# EAGLE design task_eagle (EAGLE 8.0.1)

## Sheet 1 of 5: Controller
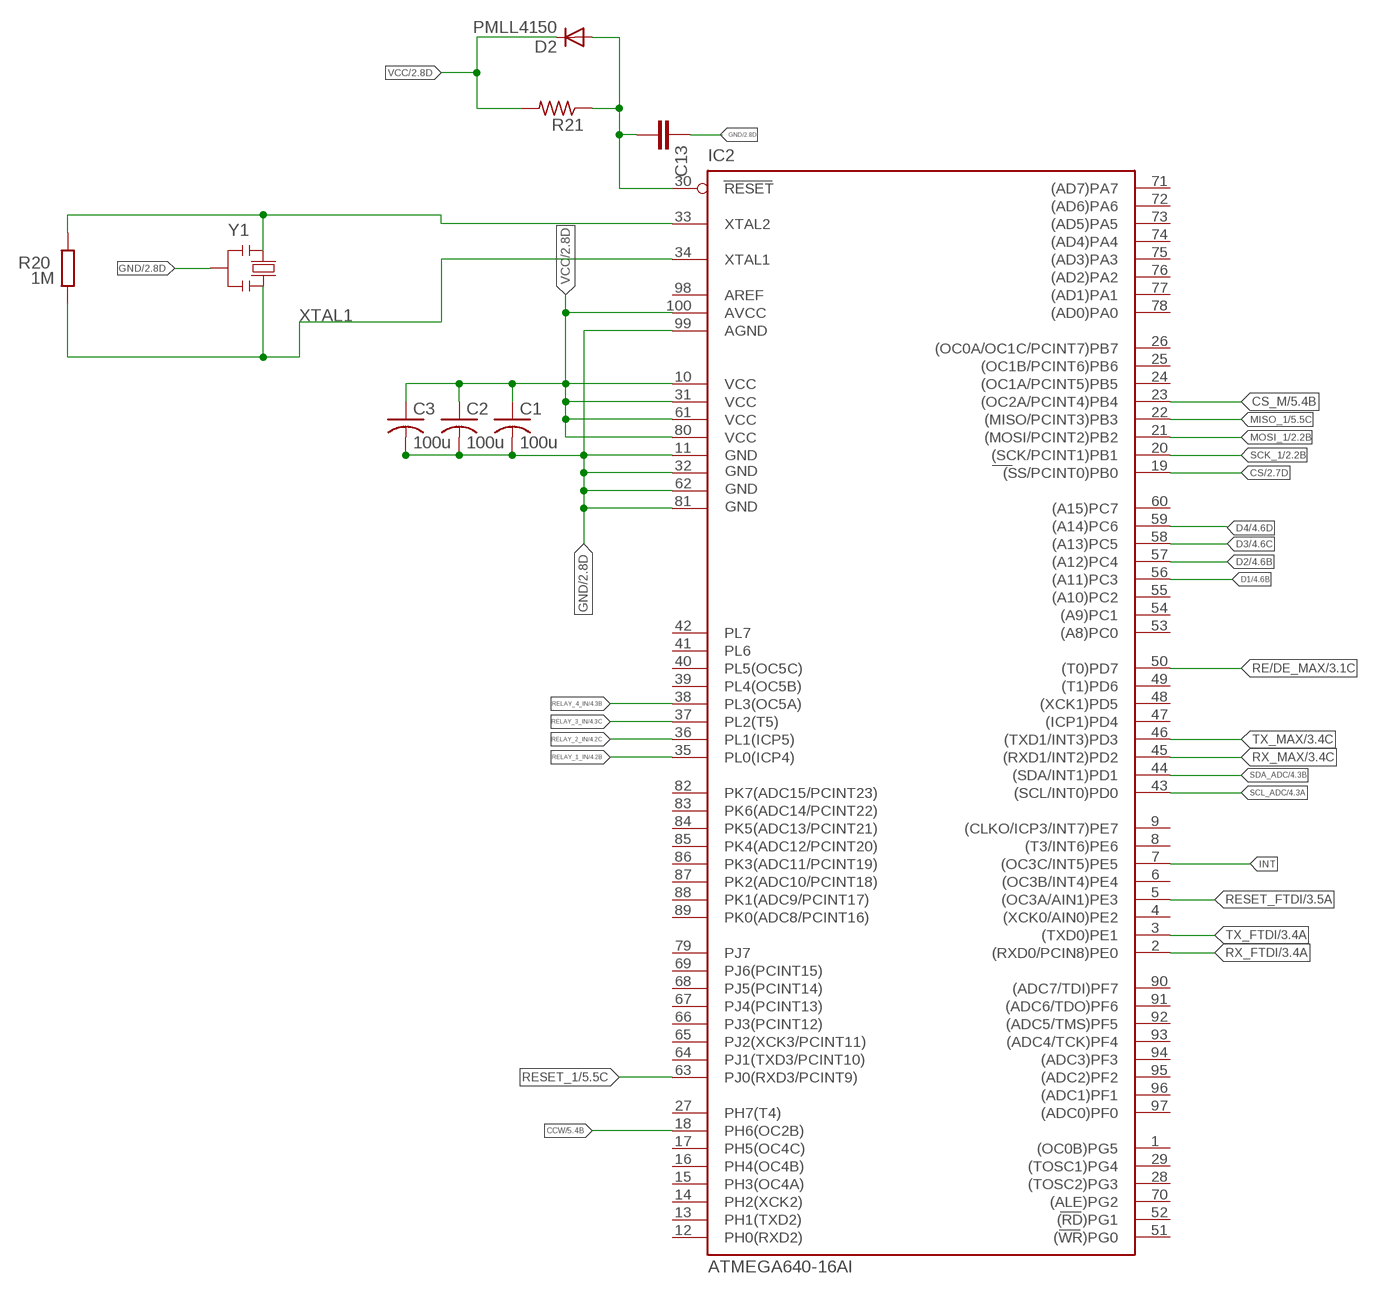
[diagram p0: schematic, sheet 1]

### Parts
C1  100u  C-USC0603  [C0603]
C2  100u  C-USC0603  [C0603]
C3  100u  C-USC0603  [C0603]
C13  CC0603  [C0603]
D2  PMLL4150  [SOD80C]
IC2  ATMEGA640-16AI  [TQFP100]
R20  1M  R-EU_R0603  [R0603-ROUND]
R21  R-US_R0603  [R0603]
Y1  RESONATORMU  [RESONATOR]

### Nets
CCW: IC2.18(PH6(OC2B)) ; also sheet 5
CS: IC2.19((SS/PCINT0)PB0) ; also sheet 2
CS_M: IC2.23((OC2A/PCINT4)PB4) ; also sheet 5
D1: IC2.56((A11)PC3) ; also sheet 4
D2: IC2.57((A12)PC4) ; also sheet 4
D3: IC2.58((A13)PC5) ; also sheet 4
D4: IC2.59((A14)PC6) ; also sheet 4
GND [def]: C1.2 C2.2 C3.2 C13.1 IC2.11(GND) IC2.32(GND1) IC2.62(GND2) IC2.81(GND3) IC2.99(AGND) Y1.2 ; also sheet 2,3,4,5
INT: IC2.7((OC3C/INT5)PE5) ; also sheet 2
MISO_1: IC2.22((MISO/PCINT3)PB3) ; also sheet 2,5
MOSI_1: IC2.21((MOSI/PCINT2)PB2) ; also sheet 2,5
N$17: C13.2 D2.A IC2.30(RESET) R21.1
RE/DE_MAX: IC2.50((T0)PD7) ; also sheet 3
RELAY_1_IN: IC2.35(PL0(ICP4)) ; also sheet 4
RELAY_2_IN: IC2.36(PL1(ICP5)) ; also sheet 4
RELAY_3_IN: IC2.37(PL2(T5)) ; also sheet 4
RELAY_4_IN: IC2.38(PL3(OC5A)) ; also sheet 4
RESET_1: IC2.63(PJ0(RXD3/PCINT9)) ; also sheet 5
RESET_FTDI: IC2.5((OC3A/AIN1)PE3) ; also sheet 3
RX_FTDI: IC2.2((RXD0/PCIN8)PE0) ; also sheet 3
RX_MAX: IC2.45((RXD1/INT2)PD2) ; also sheet 3
SCK_1: IC2.20((SCK/PCINT1)PB1) ; also sheet 2,5
SCL_ADC: IC2.43((SCL/INT0)PD0) ; also sheet 4
SDA_ADC: IC2.44((SDA/INT1)PD1) ; also sheet 4
TX_FTDI: IC2.3((TXD0)PE1) ; also sheet 3
TX_MAX: IC2.46((TXD1/INT3)PD3) ; also sheet 3
VCC [vcc]: C1.1 C2.1 C3.1 D2.C IC2.10(VCC) IC2.31(VCC1) IC2.61(VCC2) IC2.80(VCC3) IC2.100(AVCC) R21.2 ; also sheet 2,3,4
XTAL1: IC2.34(XTAL1) R20.1 Y1.3
XTAL2: IC2.33(XTAL2) R20.2 Y1.1
Unconnected: IC2.1((OC0B)PG5) IC2.4((XCK0/AIN0)PE2) IC2.6((OC3B/INT4)PE4) IC2.8((T3/INT6)PE6) IC2.9((CLKO/ICP3/INT7)PE7) IC2.12(PH0(RXD2)) IC2.13(PH1(TXD2)) IC2.14(PH2(XCK2)) IC2.15(PH3(OC4A)) IC2.16(PH4(OC4B)) IC2.17(PH5(OC4C)) IC2.24((OC1A/PCINT5)PB5) IC2.25((OC1B/PCINT6)PB6) IC2.26((OC0A/OC1C/PCINT7)PB7) IC2.27(PH7(T4)) IC2.28((TOSC2)PG3) IC2.29((TOSC1)PG4) IC2.39(PL4(OC5B)) IC2.40(PL5(OC5C)) IC2.41(PL6) IC2.42(PL7) IC2.47((ICP1)PD4) IC2.48((XCK1)PD5) IC2.49((T1)PD6) IC2.51((WR)PG0) IC2.52((RD)PG1) IC2.53((A8)PC0) IC2.54((A9)PC1) IC2.55((A10)PC2) IC2.60((A15)PC7) IC2.64(PJ1(TXD3/PCINT10)) IC2.65(PJ2(XCK3/PCINT11)) IC2.66(PJ3(PCINT12)) IC2.67(PJ4(PCINT13)) IC2.68(PJ5(PCINT14)) IC2.69(PJ6(PCINT15)) IC2.70((ALE)PG2) IC2.71((AD7)PA7) IC2.72((AD6)PA6) IC2.73((AD5)PA5) IC2.74((AD4)PA4) IC2.75((AD3)PA3) IC2.76((AD2)PA2) IC2.77((AD1)PA1) IC2.78((AD0)PA0) IC2.79(PJ7) IC2.82(PK7(ADC15/PCINT23)) IC2.83(PK6(ADC14/PCINT22)) IC2.84(PK5(ADC13/PCINT21)) IC2.85(PK4(ADC12/PCINT20)) IC2.86(PK3(ADC11/PCINT19)) IC2.87(PK2(ADC10/PCINT18)) IC2.88(PK1(ADC9/PCINT17)) IC2.89(PK0(ADC8/PCINT16)) IC2.90((ADC7/TDI)PF7) IC2.91((ADC6/TDO)PF6) IC2.92((ADC5/TMS)PF5) IC2.93((ADC4/TCK)PF4) IC2.94((ADC3)PF3) IC2.95((ADC2)PF2) IC2.96((ADC1)PF1) IC2.97((ADC0)PF0) IC2.98(AREF)

## Sheet 2 of 5: Ethernet
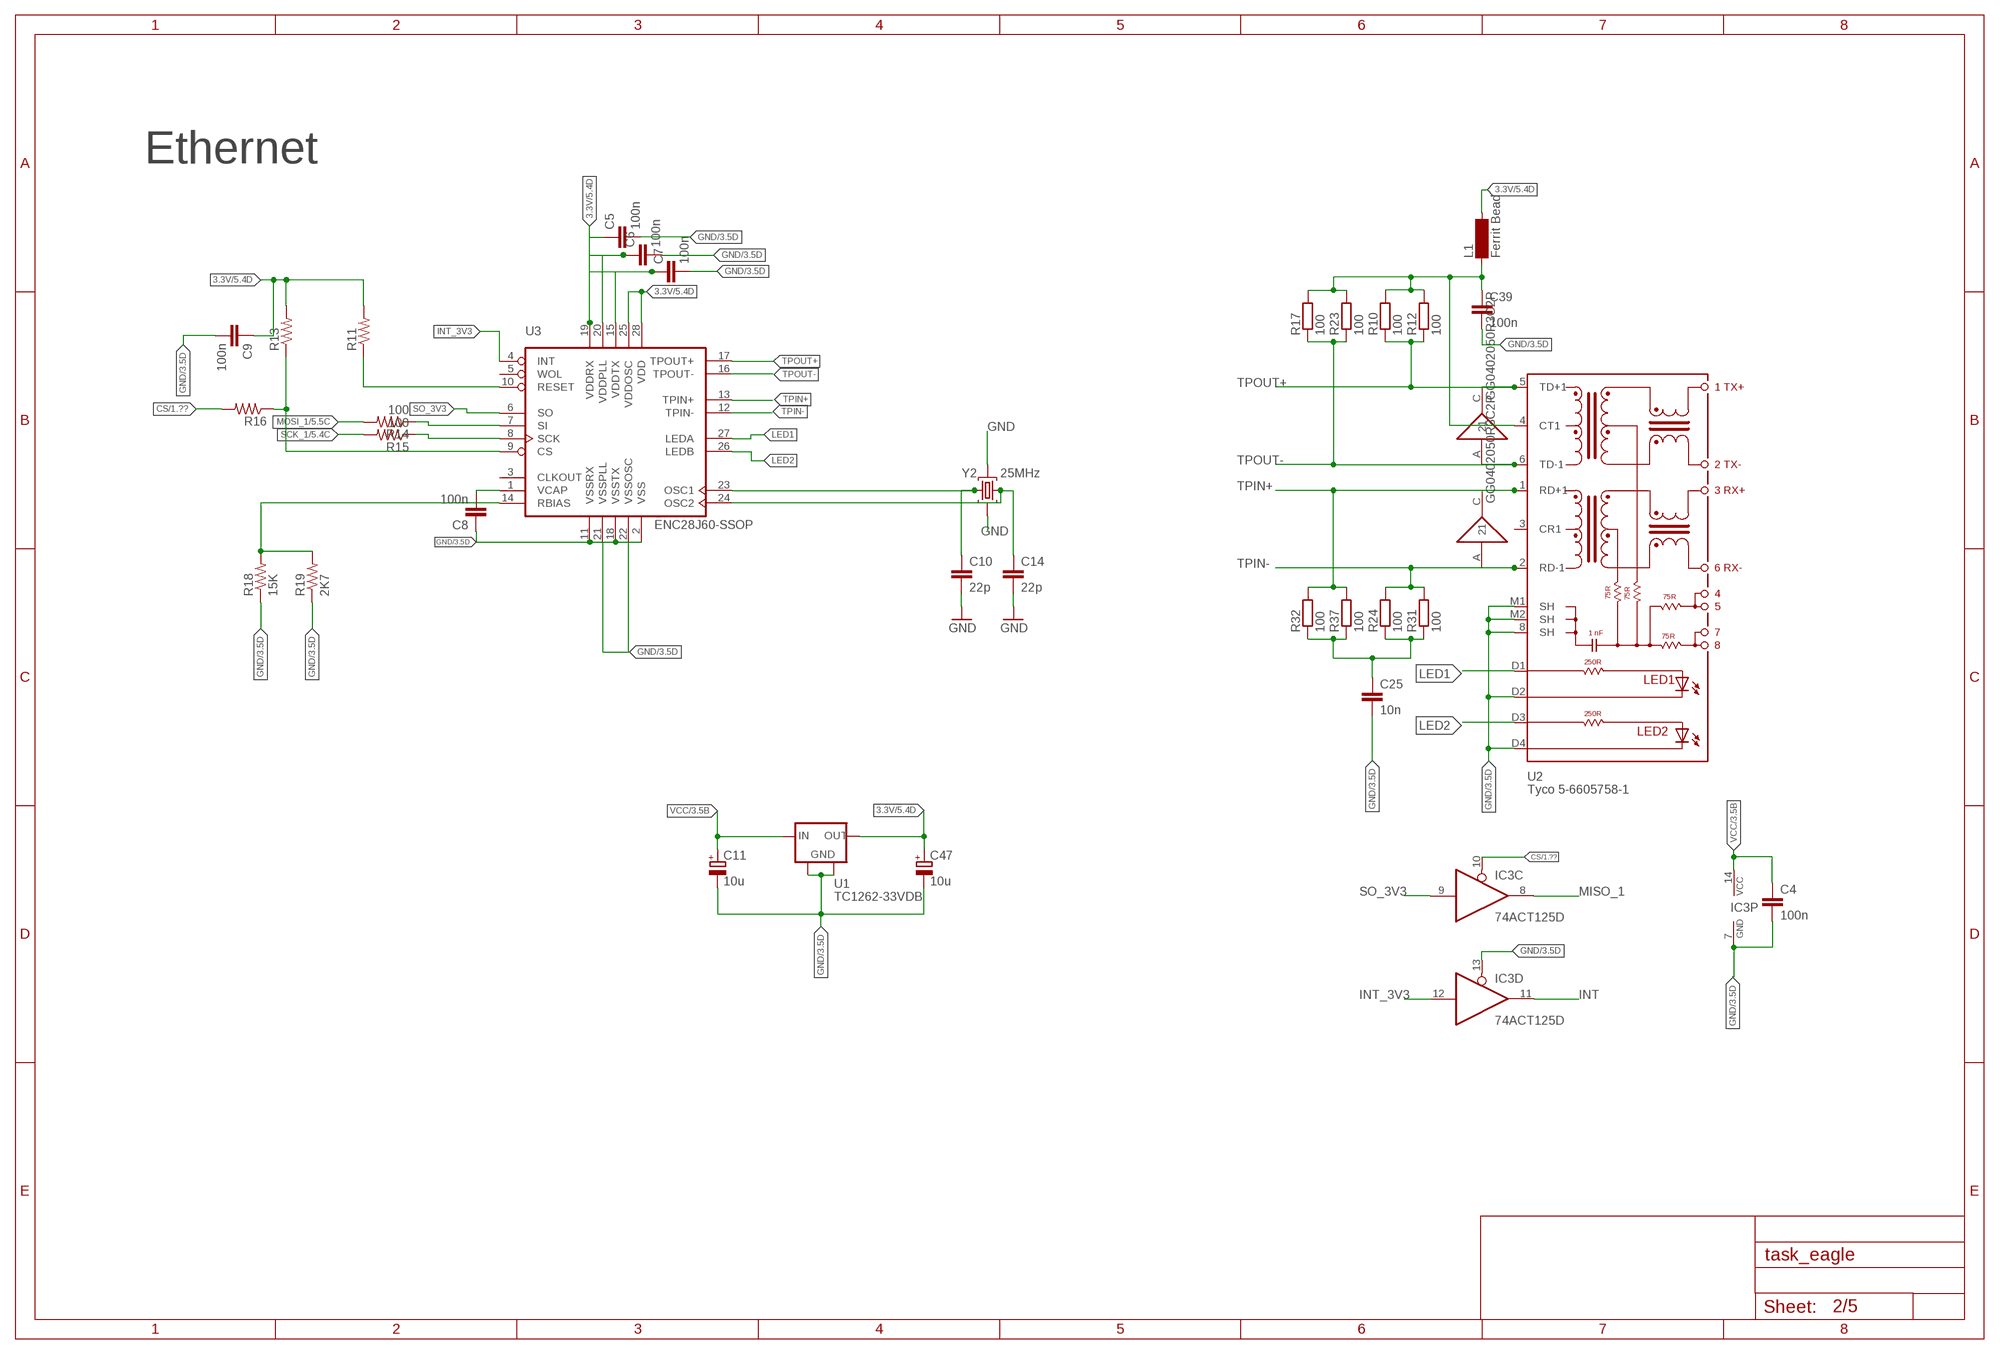
[diagram p1: schematic, sheet 2]

### Parts
C4  100n  C-EUC0603  [C0603]
C5  100n  C-EUC0603  [C0603]
C6  100n  C-EUC0603  [C0603]
C7  100n  C-EUC0603  [C0603]
C8  100n  C-EUC0603  [C0603]
C9  100n  C-EUC0603  [C0603]
C10  22p  C-EUC0603  [C0603]
C11  10u  CPOL-EU153CLV-0605  [153CLV-0605]
C14  22p  C-EUC0603  [C0603]
C25  10n  C-EUC0603  [C0603]
C39  100n  C-EUC0603  [C0603]
C47  10u  CPOL-EU153CLV-0605  [153CLV-0605]
IC3  74ACT125D  [SO14]
L1  Ferrit Bead  SM-1206  [SM-1206]
R10  100  R-EU_R0603  [R0603]
R11  R-US_R0603  [R0603]
R12  100  R-EU_R0603  [R0603]
R13  R-US_R0603  [R0603]
R14  100  R-US_R0603  [R0603]
R15  100  R-US_R0603  [R0603]
R16  R-US_R0603  [R0603]
R17  100  R-EU_R0603  [R0603]
R18  15K  R-US_R0603  [R0603]
R19  2K7  R-US_R0603  [R0603]
R23  100  R-EU_R0603  [R0603]
R24  100  R-EU_R0603  [R0603]
R31  100  R-EU_R0603  [R0603]
R32  100  R-EU_R0603  [R0603]
R37  100  R-EU_R0603  [R0603]
U1  TC1262-33VDB  TC1262-50VDB  [SOT223]
U2  Tyco 5-6605758-1  5-6605758-1  [5-6605758-1]
U3  ENC28J60-SSOP  [SSOP28]
U$6  GG0402050R3C2P  [0402]
U$7  GG0402050R3C2P  [0402]
Y2  25MHz  CRYSTAL-3.2-2.5  [CRYSTAL-3.2-2.5]

### Nets
3.3V [def]: C5.1 C6.1 C7.1 C9.1 C47.+ L1.2 R11.2 R13.2 U1.3(OUT) U3.15(VDDTX) U3.19(VDDRX) U3.20(VDDPLL) U3.25(VDDOSC) U3.28(VDD) ; also sheet 5
CS: IC3.10(C:OE) R16.2 ; also sheet 1
GND [def]: C4.2 C5.2 C6.2 C7.2 C8.1 C9.2 C10.2 C11.- C14.2 C25.2 C39.2 C47.- IC3.7(P:GND) IC3.13(D:OE) R18.1 R19.1 U1.2(GND) U1.4(GND) U2.8(SH) U2.D2 U2.D4 U2.M1(SH) U2.M2(SH) U3.2(VSS) U3.11(VSSRX) U3.18(VSSTX) U3.21(VSSPLL) U3.22(VSSOSC) Y2.2(GND) Y2.4(GND) ; also sheet 1,3,4,5
INT: IC3.11(D:O) ; also sheet 1
INT_3V3: IC3.12(D:I) U3.4(INT)
LED1: U2.D1 U3.27(LEDA)
LED2: U2.D3 U3.26(LEDB)
MISO_1: IC3.8(C:O) ; also sheet 1,5
MOSI_1: R14.2 ; also sheet 1,5
N$11: R11.1 U3.10(RESET)
N$12: R13.1 R16.1 U3.9(CS)
N$13: R14.1 U3.7(SI)
N$14: R18.2 R19.2 U3.14(RBIAS)
N$15: R15.1 U3.8(SCK)
N$16: C8.2 U3.1(VCAP)
N$21: C10.1 U3.23(OSC1) Y2.3(C2)
N$22: C25.1 R24.1 R31.1 R32.1 R37.1
N$23: C39.1 L1.1 R10.2 R12.2 R17.2 R23.2 U2.4(CT1)
N$25: C14.1 U3.24(OSC2) Y2.1(C1)
SCK_1: R15.2 ; also sheet 1,5
SO_3V3: IC3.9(C:I) U3.6(SO)
TPIN+: R32.2 R37.2 U2.1(RD+1) U3.13(TPIN+) U$7.C
TPIN-: R24.2 R31.2 U2.2(RD-1) U3.12(TPIN-) U$7.A
TPOUT+: R10.1 R12.1 U2.5(TD+1) U3.17(TPOUT+) U$6.C
TPOUT-: R17.1 R23.1 U2.6(TD-1) U3.16(TPOUT-) U$6.A
VCC [vcc]: C4.1 C11.+ IC3.14(P:VCC) U1.1(IN) ; also sheet 1,3,4
Unconnected: IC3.1(A:OE) IC3.2(A:I) IC3.3(A:O) IC3.4(B:OE) IC3.5(B:I) IC3.6(B:O) U2.3(CR1) U3.3(CLKOUT) U3.5(WOL)

### Notes on the sheet
- Ethernet

## Sheet 3 of 5: RS485 Serial Communication
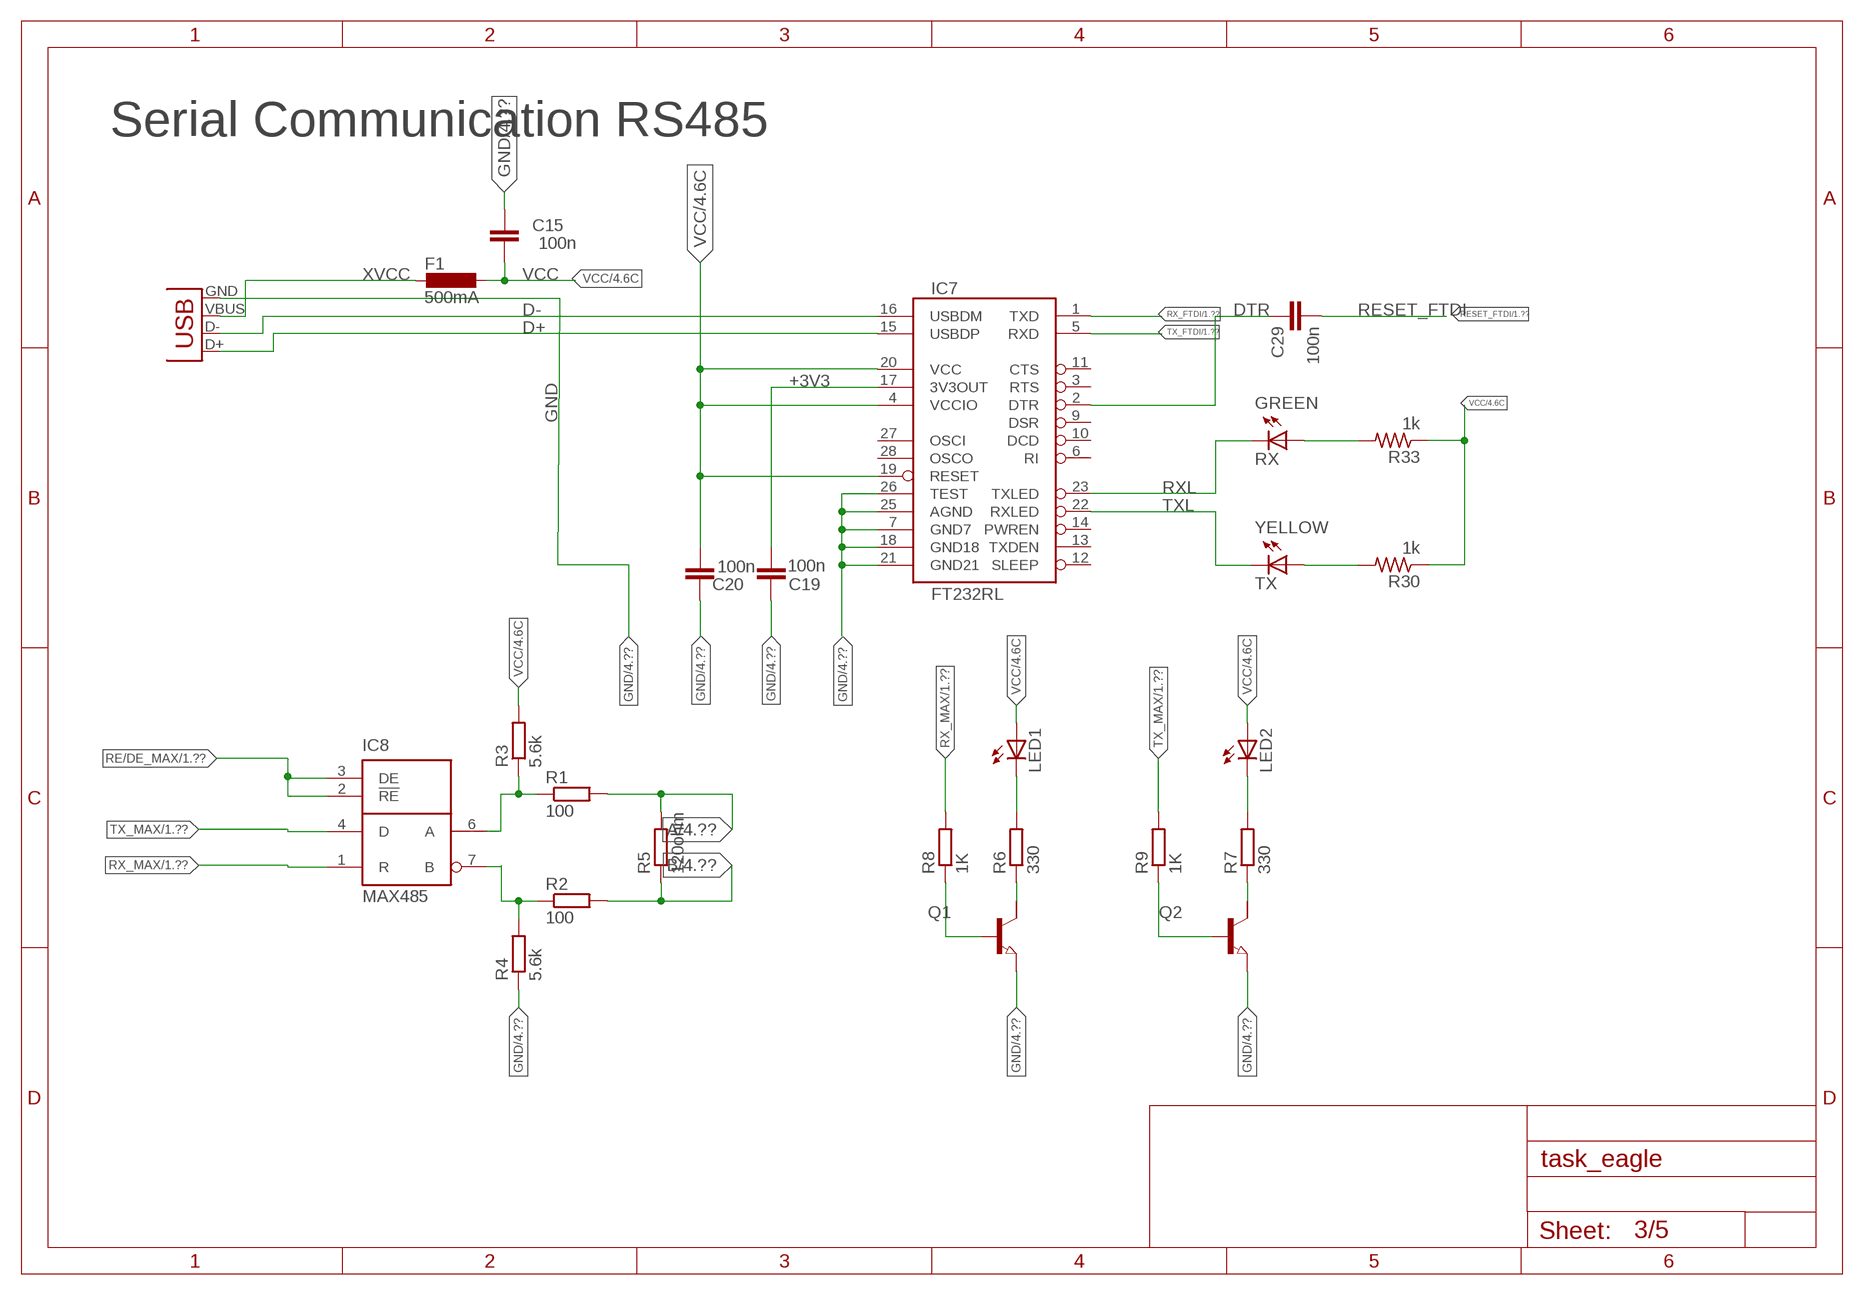
[diagram p2: schematic, sheet 3]

### Parts
C15  100n  C-EUC0603  [C0603]
C19  100n  C-EU0603-RND  [C0603-ROUND]
C20  100n  C-EU0603-RND  [C0603-ROUND]
C29  100n  C-EU0603-RND  [C0603-ROUND]
F1  500mA  L-EUL1812  [L1812]
IC7  FT232RL  FT232RLSSOP  [SSOP28DB]
IC8  MAX485  75ALS176AD  [SO-08]
LED1  LED_ESML0603  [LED_SML0603]
LED2  LED_ESML0603  [LED_SML0603]
Q1  NPN-TRANSISTIOR-2COLSOT89  [SOT89]
Q2  NPN-TRANSISTIOR-2COLSOT89  [SOT89]
R1  100  RR0603  [R0603]
R2  100  RR0603  [R0603]
R3  5.6k  RR0603  [R0603]
R4  5.6k  RR0603  [R0603]
R5  120ohm  RR0603  [R0603]
R6  330  RR0603  [R0603]
R7  330  RR0603  [R0603]
R8  1K  RR0603  [R0603]
R9  1K  RR0603  [R0603]
R30  1k  R-US_R0603  [R0603]
R33  1k  R-US_R0603  [R0603]
RX  GREEN  LEDCHIPLED_0603  [CHIPLED_0603]
TX  YELLOW  LEDCHIPLED_0603  [CHIPLED_0603]
USB  USB  USBPTH-VERTICAL  [USB-B-PTH-VERTICAL]

### Nets
+3V3: C19.2 IC7.17(3V3OUT)
A: R1.2 R5.2 ; also sheet 4
B: R2.2 R5.1 ; also sheet 4
D+: IC7.15(USBDP) USB.D+
D-: IC7.16(USBDM) USB.D-
DTR: C29.1 IC7.2(DTR)
GND [def]: C15.2 C19.1 C20.2 IC7.7(GND7) IC7.18(GND18) IC7.21(GND21) IC7.25(AGND) IC7.26(TEST) Q1.3(E) Q2.3(E) R4.1 USB.GND ; also sheet 1,2,4,5
N$1: IC8.6(A) R1.1 R3.1
N$2: IC8.7(B) R2.1 R4.2
N$3: R30.2 TX.A
N$5: LED1.C R6.2
N$6: LED2.C R7.2
N$7: Q1.2(C) R6.1
N$8: Q2.2(C) R7.1
N$9: Q2.1(B) R9.1
N$10: Q1.1(B) R8.1
N$28: R33.2 RX.A
RE/DE_MAX: IC8.2(!RE) IC8.3(DE) ; also sheet 1
RESET_FTDI: C29.2 ; also sheet 1
RX_FTDI: IC7.1(TXD) ; also sheet 1
RX_MAX: IC8.1(R) R8.2 ; also sheet 1
RXL: IC7.23(TXLED) RX.C
TX_FTDI: IC7.5(RXD) ; also sheet 1
TX_MAX: IC8.4(D) R9.2 ; also sheet 1
TXL: IC7.22(RXLED) TX.C
VCC [vcc]: C15.1 C20.1 F1.1 IC7.4(VCCIO) IC7.19(RESET) IC7.20(VCC) LED1.A LED2.A R3.2 R30.1 R33.1 ; also sheet 1,2,4
XVCC [vcc]: F1.2 USB.VBUS
Unconnected: IC7.3(RTS) IC7.6(RI) IC7.9(DSR) IC7.10(DCD) IC7.11(CTS) IC7.12(SLEEP) IC7.13(TXDEN) IC7.14(PWREN) IC7.27(OSCI) IC7.28(OSCO) Q1.2@1(C/) Q2.2@1(C/)

### Notes on the sheet
- Serial Communication RS485

## Sheet 4 of 5: Power Distribution
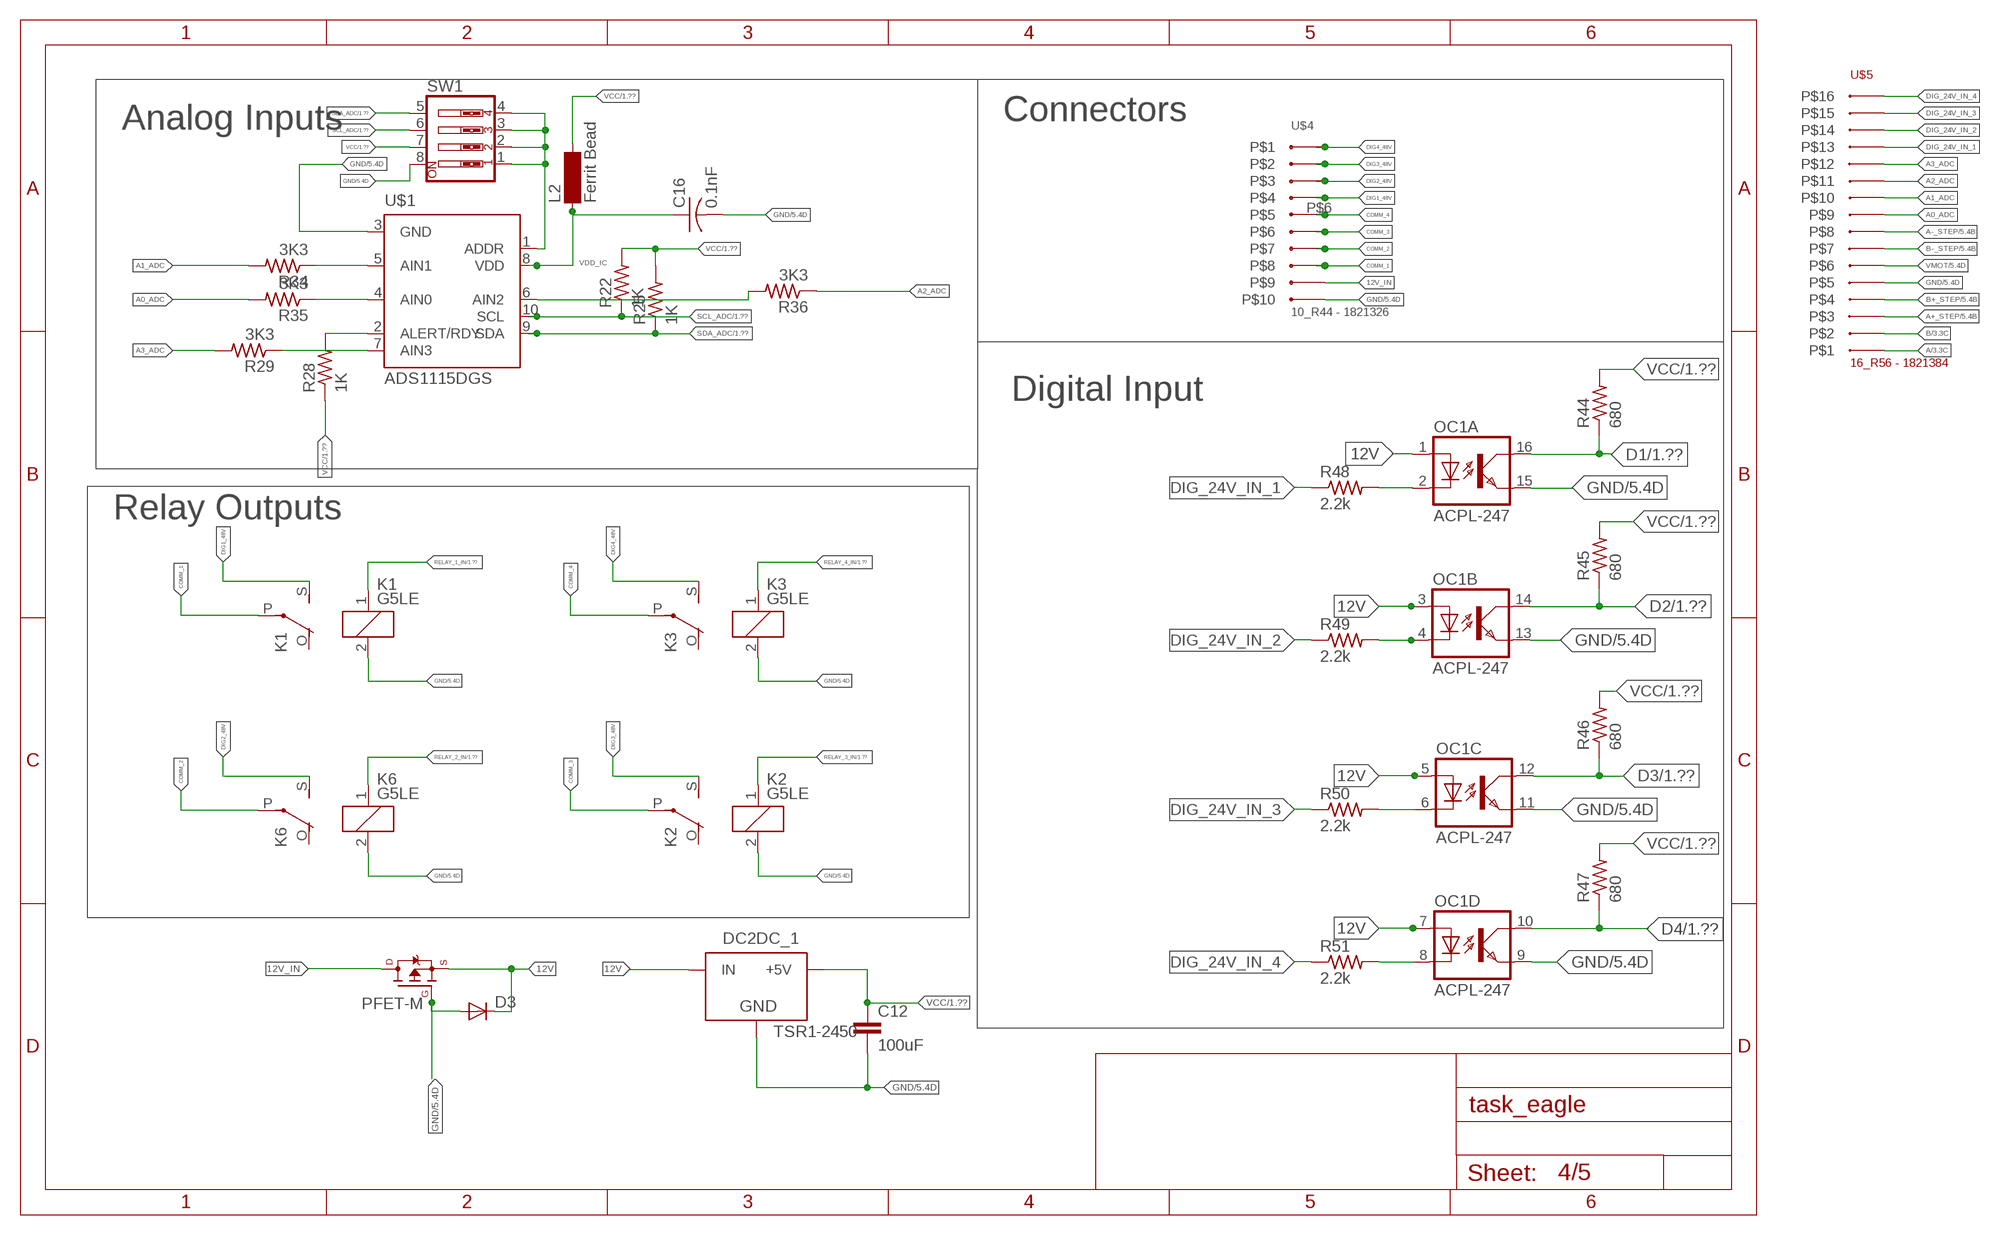
[diagram p3: schematic, sheet 4]

### Parts
C12  100uF  CC0603  [C0603]
C16  0.1nF  C-USC0603  [C0603]
D3  DIODE-MINIMELF  [MINIMELF]
DC2DC_1  TSR1-2450  [TSR-1]
K1  G5LE  [G5LE]
K2  G5LE  [G5LE]
K3  G5LE  [G5LE]
K6  G5LE  [G5LE]
L2  Ferrit Bead  SM-1206  [SM-1206]
OC1  ACPL-247  [SOP16]
PFET-M  FQP47P06NORMAL  [FQP47P06-NORMAL]
R22  1K  R-US_R0603  [R0603]
R25  1K  R-US_R0603  [R0603]
R28  1K  R-US_R0603  [R0603]
R29  3K3  R-US_R0603  [R0603]
R34  3K3  R-US_R0603  [R0603]
R35  3K3  R-US_R0603  [R0603]
R36  3K3  R-US_R0603  [R0603]
R44  680  R-US_R0603  [R0603]
R45  680  R-US_R0603  [R0603]
R46  680  R-US_R0603  [R0603]
R47  680  R-US_R0603  [R0603]
R48  2.2k  R-US_R0603  [R0603]
R49  2.2k  R-US_R0603  [R0603]
R50  2.2k  R-US_R0603  [R0603]
R51  2.2k  R-US_R0603  [R0603]
SW1  SW_DIP-4  [EDG-04]
U$1  ADS1115DGS  [MSOP10]
U$4  10_R44 - 1821326  [10_R44 - 1821326]
U$5  16_R56 - 1821384  [16_R56 - 1821384]

### Nets
12V: D3.C DC2DC_1.1(IN) OC1.1(A:A) OC1.3(B:A) OC1.5(C:A) OC1.7(D:A) PFET-M.3(S)
12V_IN: PFET-M.2(D) U$4.P$10
A: U$5.P$1 ; also sheet 3
A0_ADC: R35.2 U$5.P$9
A1_ADC: R34.2 U$5.P$10
A2_ADC: R36.1 U$5.P$11
A3_ADC: R29.2 U$5.P$12
A+_STEP [V_mot]: U$5.P$3 ; also sheet 5
A-_STEP [V_mot]: U$5.P$8 ; also sheet 5
B: U$5.P$2 ; also sheet 3
B+_STEP [V_mot]: U$5.P$4 ; also sheet 5
B-_STEP [V_mot]: U$5.P$7 ; also sheet 5
COMM_1: K1.P(2:P) U$4.P$9
COMM_2: K6.P(2:P) U$4.P$8
COMM_3: K2.P(2:P) U$4.P$7
COMM_4: K3.P(2:P) U$4.P$6
D1: OC1.16(A:COL) R44.1 ; also sheet 1
D2: OC1.14(B:COL) R45.1 ; also sheet 1
D3: OC1.12(C:COL) R46.1 ; also sheet 1
D4: OC1.10(D:COL) R47.1 ; also sheet 1
DIG1_48V: K1.S(2:S) U$4.P$5
DIG2_48V: K6.S(2:S) U$4.P$4
DIG3_48V: K2.S(2:S) U$4.P$3
DIG4_48V: K3.S(2:S) U$4.P$2
DIG_24V_IN_1: R48.1 U$5.P$13
DIG_24V_IN_2: R49.1 U$5.P$14
DIG_24V_IN_3: R50.1 U$5.P$15
DIG_24V_IN_4: R51.1 U$5.P$16
GND [def]: C12.2 C16.2 D3.A DC2DC_1.2(GND) K1.2 K2.2 K3.2 K6.2 OC1.9(D:EMIT) OC1.11(C:EMIT) OC1.13(B:EMIT) OC1.15(A:EMIT) PFET-M.1(G) SW1.8 U$1.3(GND) U$4.P$11 U$5.P$5 ; also sheet 1,2,3,5
N$4: SW1.1 SW1.2 SW1.3 SW1.4 U$1.1(ADDR)
N$18: R34.1 U$1.5(AIN1)
N$20: R35.1 U$1.4(AIN0)
N$24: R29.1 U$1.7(AIN3)
N$26: R28.2 U$1.2(ALERT/RDY)
N$27: R36.2 U$1.6(AIN2)
N$29: OC1.4(B:C) R49.2
N$30: OC1.8(D:C) R51.2
N$31: OC1.6(C:C) R50.2
N$32: OC1.2(A:C) R48.2
RELAY_1_IN: K1.1 ; also sheet 1
RELAY_2_IN: K6.1 ; also sheet 1
RELAY_3_IN: K2.1 ; also sheet 1
RELAY_4_IN: K3.1 ; also sheet 1
SCL_ADC: R22.1 SW1.6 U$1.10(SCL) ; also sheet 1
SDA_ADC: R25.1 SW1.5 U$1.9(SDA) ; also sheet 1
VCC [vcc]: C12.1 DC2DC_1.3(+5V) L2.2 R22.2 R25.2 R28.1 R44.2 R45.2 R46.2 R47.2 SW1.7 ; also sheet 1,2,3
VDD_IC: C16.1 L2.1 U$1.8(VDD)
VMOT: U$5.P$6 ; also sheet 5
Unconnected: K1.O(2:O) K2.O(2:O) K3.O(2:O) K6.O(2:O)

### Notes on the sheet
- Analog Inputs | Connectors
- Digital Input
- Relay Outputs

## Sheet 5 of 5: Powerstep
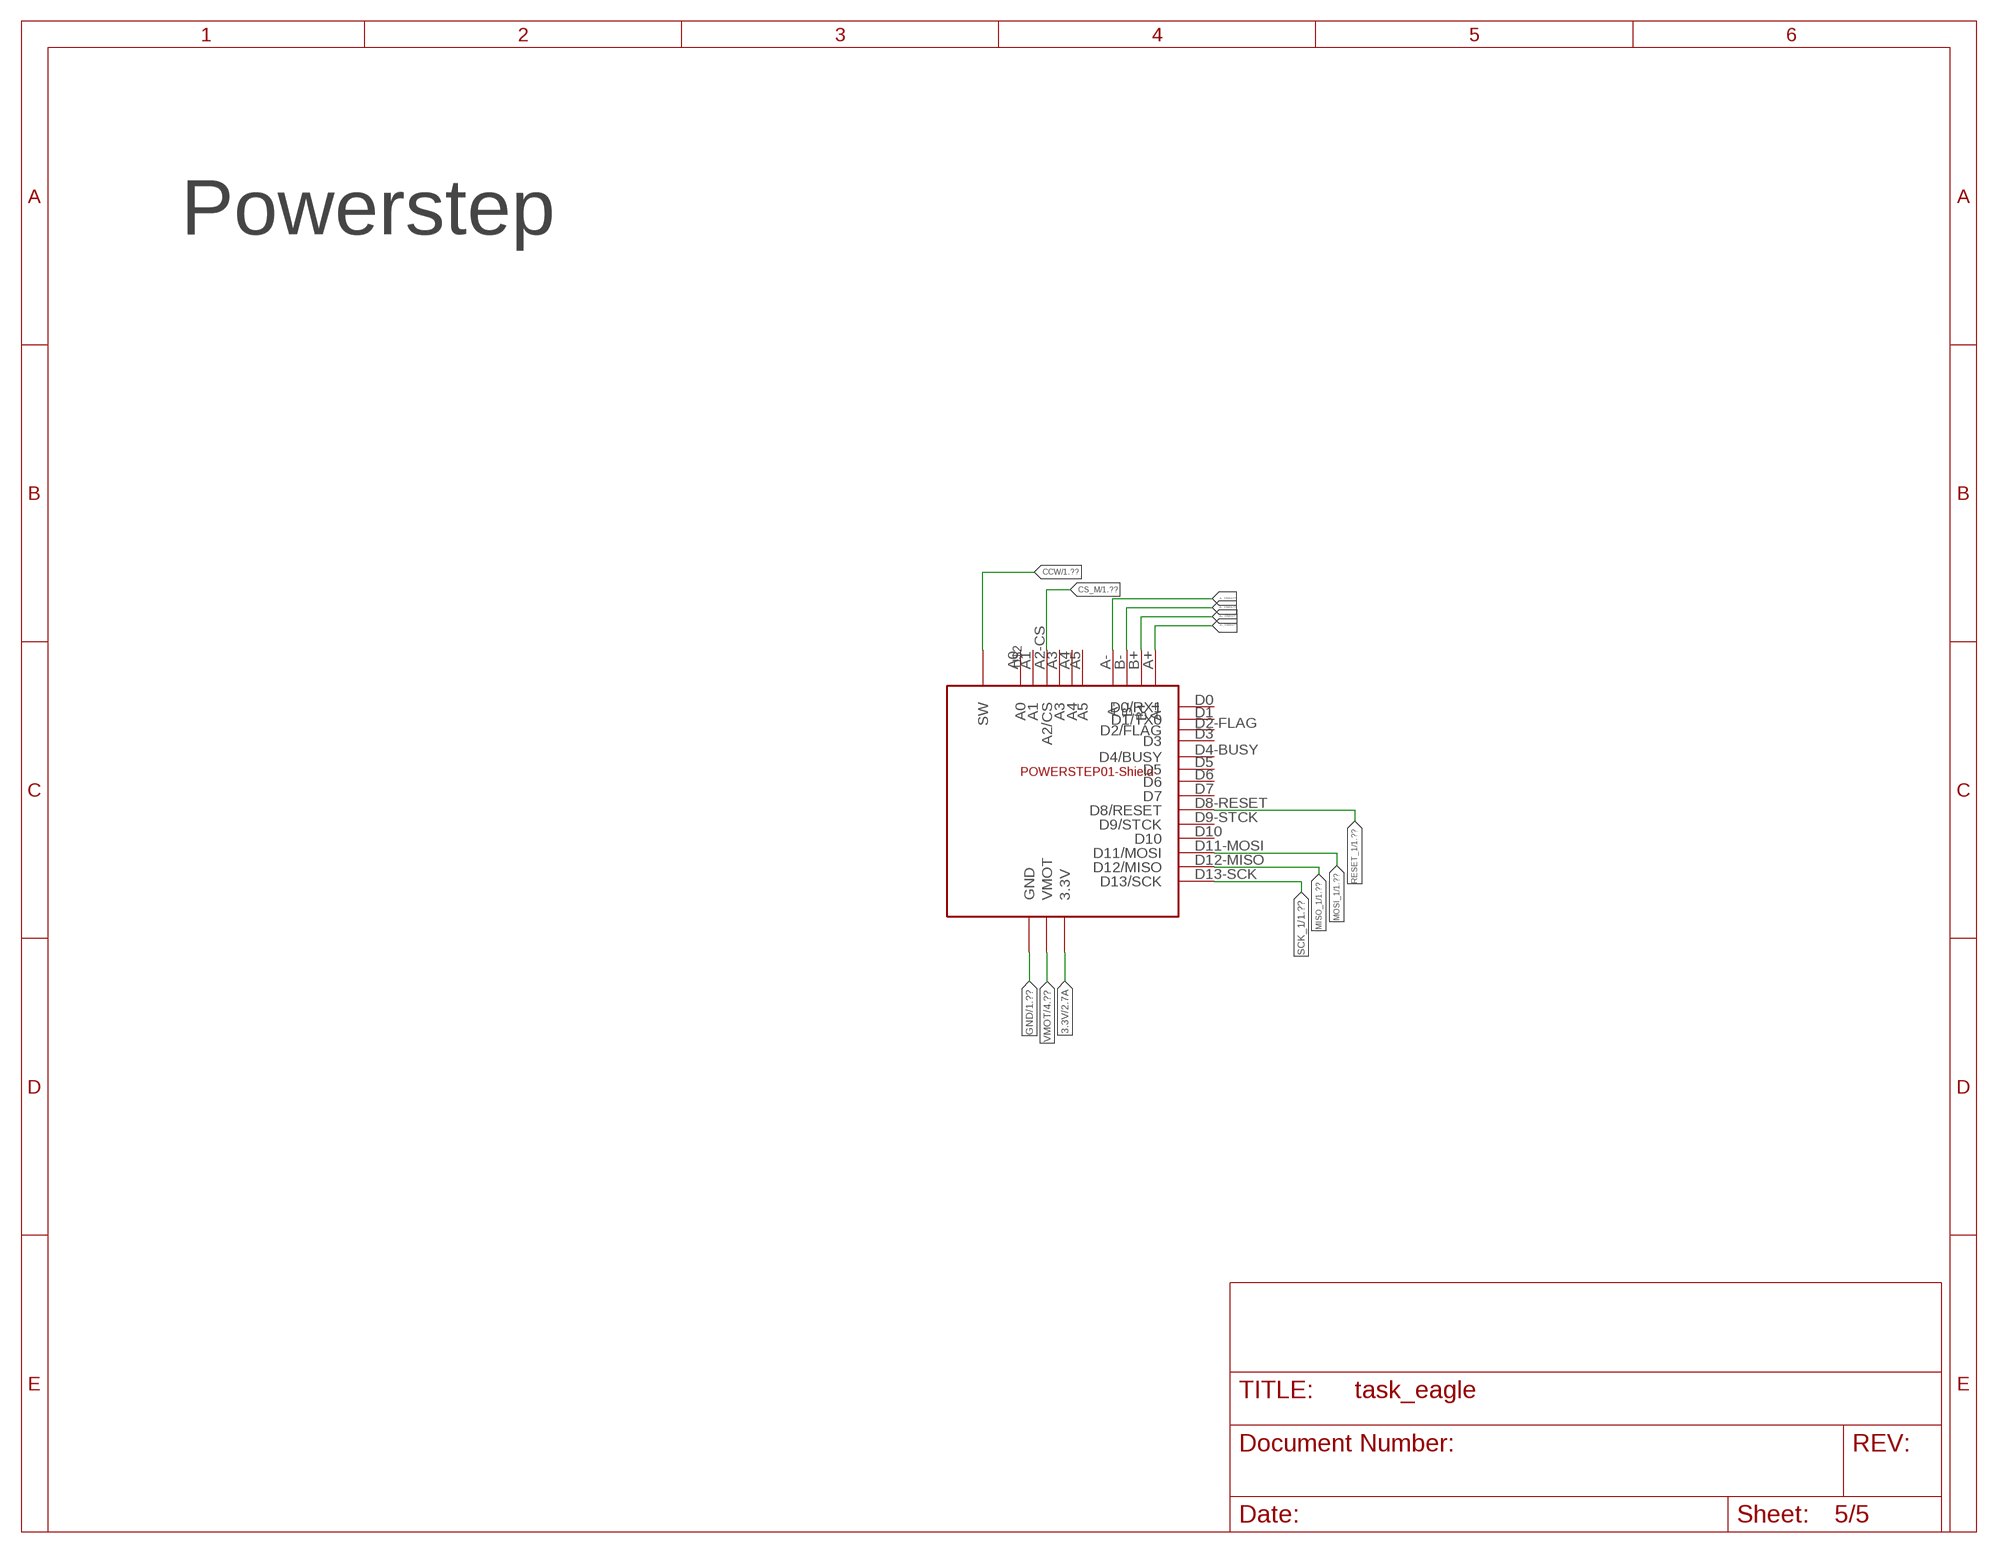
[diagram p4: schematic, sheet 5]

### Parts
U$2  POWERSTEP01-SHIELD  [POWERSTEP1]

### Nets
3.3V [def]: U$2.3.3V U$2.IOREF(3.3V) ; also sheet 2
A+_STEP [V_mot]: U$2.A+ ; also sheet 4
A-_STEP [V_mot]: U$2.A- ; also sheet 4
B+_STEP [V_mot]: U$2.B+ ; also sheet 4
B-_STEP [V_mot]: U$2.B- ; also sheet 4
CCW: U$2.SW ; also sheet 1
CS_M: U$2.A2-CS(A2/CS) ; also sheet 1
GND [def]: U$2.GND@0(GND) U$2.GND@1(GND) U$2.GND@2(GND) U$2.GND@3(GND) ; also sheet 1,2,3,4
MISO_1: U$2.D12-MISO(D12/MISO) ; also sheet 1,2
MOSI_1: U$2.D11-MOSI(D11/MOSI) ; also sheet 1,2
RESET_1: U$2.D8-RESET(D8/RESET) ; also sheet 1
SCK_1: U$2.D13-SCK(D13/SCK) ; also sheet 1,2
VMOT: U$2.VS+(VMOT) ; also sheet 4
Unconnected: U$2.A0 U$2.A1 U$2.A3 U$2.A4 U$2.A5 U$2.D0(D0/RX1) U$2.D1(D1/TX0) U$2.D2-FLAG(D2/FLAG) U$2.D3 U$2.D4-BUSY(D4/BUSY) U$2.D5 U$2.D6 U$2.D7 U$2.D9-STCK(D9/STCK) U$2.D10

### Notes on the sheet
- Powerstep

## Power pins joined to a net without a drawn wire
GND: IC8.5(GND)
VCC: IC8.8(VCC)

## Library data of the parts
C1-C3 C16 = rcl:C-US: CAPACITOR, American symbol
C4-C10 C14 C15 C25 C39 = rcl:C-EU: CAPACITOR, European symbol
C11 C47 = resistor:CPOL-EU: POLARIZED CAPACITOR, European symbol
C12 C13 = eagle-ltspice:C: CAPACITOR, European symbol; SPICEMODEL: NONE; SPICEPREFIX: C
C19 C20 C29 = SmartPrj:C-EU: CAPACITOR, European symbol
D2 = diode:PMLL4150: DIODE high speed
D3 = diode:DIODE-: DIODE
DC2DC_1 = SteelCaveRobotics-Power:TSR1-2450: Traco Power TSR 1-2450 5.0v switching regulator
F1 = rcl:L-EU: INDUCTOR, European symbol
IC2 = atmel-2005:ATMEGA*: MICROCONTROLLER 64/128/256 Kbytes FLASH 4 Kbytes EEPROM 8 Kbytes SRAM 86 General Purpose I/O pins 12-channels16-bit PWM 4 x Serial USARTs 16-channels 10-bit A/D
IC3 = 74xx-eu:74*125: Quad bus BUFFER, 3-state
IC7 = SparkFun:FT232RL: USB UART FT232RL 4th Generation USB UART (USB <-> Serial) Controller. Spark Fun Electronics SKU : COM-00650
IC8 = texas:75ALS176: DIFFERENTIAL BUS TRANSCEIVERS TIA/EIA-422-B, TIA/EIA-422-B + TIA/EIA-422-B TIA/EIA-422-B Operate at Data Rates up to 35 Mbaud Source: http://focus.ti.com/lit/ds/symlink/sn65als176.pdf; MF: TEXAS INSTRUMENTS; MPN: SN75ALS176AD; OC_FARNELL: 1410742; OC_NEWARK: 76C5099
K1-K3 K6 = relay:G5LE: RELAY 1 x switch, 10 A/120 V AC, 8 A/30 V DC, Omron; OC_FARNELL: unknown; OC_NEWARK: unknown
L1 L2 = inductor-neosid:SM-1206: INDUCTOR SMD chip inductor; OC_FARNELL: unknown; OC_NEWARK: unknown
LED1 LED2 = eagle-ltspice:LED_E: LED Source: http://www.osram.convergy.de Source: www.luxeon.com Source: www.kingbright.com; SPICEMODEL: NONE; SPICEPREFIX: D; SPICETYPE: diode
OC1 = avago:ACPL-247
PFET-M = FQP47P06:FQP47P06
Q1 Q2 = semicon-smd-ipc:NPN-TRANSISTIOR-2COL: NPN TRANSISTOR 2 colletor pins
R1-R9 = eagle-ltspice:R: RESISTOR, European symbol; SPICEMODEL: NONE; SPICEPREFIX: R
R10 R12 R17 R23 R24 R31 R32 R37 = rcl:R-EU_: RESISTOR, European symbol
R11 R13-R16 R18 R19 R44-R51 = rcl:R-US_: RESISTOR, American symbol
R20 = SmartPrj:R-EU_: RESISTOR, European symbol
R21 R22 R25 R28-R30 R33-R36 = resistor:R-US_: RESISTOR, American symbol
RX TX = led:LED: LED OSRAM: - CHIPLED LG R971, LG N971, LY N971, LG Q971, LY Q971, LO R971, LY R971 LH N974, LH R974 LS Q976, LO Q976, LY Q976 LO Q996 - Hyper CHIPLED LW Q18S LB Q993, LB Q99A, LB R99A - SideLED LS A670, LO A670, LY A670, LG A670, LP A670 LB A673, LV A673, LT A673, LW A673 LH A674 LY A675 LS A676, LA A676, LO A676, LY A676, LW A676 LS A679, LY A679, LG A679 - Hyper Micro SIDELED® LS Y876, LA Y876, LO Y876, LY Y876 LT Y87S - SmartLED LW L88C, LW L88S LB L89C, LB L89S, LG L890 LS L89K, LO L89K, LY L89K LS L896, LA L896, LO L896, LY L896 - TOPLED LS T670, LO T670, LY T670, LG T670, LP T670 LSG T670, LSP T670, LSY T670, LOP T670, LYG T670 LG T671, LOG T671, LSG T671 LB T673, LV T673, LT T673, LW T673 LH T674 LS T676, LA T676, LO T676, LY T676, LB T676, LH T676, LSB T676, LW T676 LB T67C, LV T67C, LT T67C, LS T67K, LO T67K, LY T67K, LW E67C LS E67B, LA E67B, LO E67B, LY E67B, LB E67C, LV E67C, LT E67C LW T67C LS T679, LY T679, LG T679 LS T770, LO T770, LY T770, LG T770, LP T770 LB T773, LV T773, LT T773, LW T773 LH T774 LS E675, LA E675, LY E675, LS T675 LS T776, LA T776, LO T776, LY T776, LB T776 LHGB T686 LT T68C, LB T68C - Hyper Mini TOPLED® LB M676 - Mini TOPLED Santana® LG M470 LS M47K, LO M47K, LY M47K Source: http://www.osram.convergy.de LUXEON: - LUMILED® LXK2-PW12-R00, LXK2-PW12-S00, LXK2-PW14-U00, LXK2-PW14-V00 LXK2-PM12-R00, LXK2-PM12-S00, LXK2-PM14-U00 LXK2-PE12-Q00, LXK2-PE12-R00, LXK2-PE12-S00, LXK2-PE14-T00, LXK2-PE14-U00 LXK2-PB12-K00, LXK2-PB12-L00, LXK2-PB12-M00, LXK2-PB14-N00, LXK2-PB14-P00, LXK2-PB14-Q00 LXK2-PR12-L00, LXK2-PR12-M00, LXK2-PR14-Q00, LXK2-PR14-R00 LXK2-PD12-Q00, LXK2-PD12-R00, LXK2-PD12-S00 LXK2-PH12-R00, LXK2-PH12-S00 LXK2-PL12-P00, LXK2-PL12-Q00, LXK2-PL12-R00 Source: www.luxeon.com KINGBRIGHT: KA-3528ASYC Source: www.kingbright.com
SW1 = special:SW_DIP-4: DIP SWITCH
U1 = v-reg-misc:TC1262
U2 = con-tycoelectronics-1:5-6605758-1
U3 = microchip-enc28j60:ENC28J60-*: Microchip 10Mbit Eth. contoller with SPI interface
U$1 = ADS1115DGS:ADS1115DGS
U$2 = powerSTEP01-Shield:POWERSTEP01-SHIELD
U$4 = Pheonix_connectors:10_R44 - 1821326; PAIR_CON: PN_1821177
U$5 = Pheonix_connectors:16_R56 - 1821384; PAIR_CON: PN_1821232
U$6 U$7 = GG0402050R3C2P:GG0402050R3C2P
USB = SparkFun-Connectors:USB: USB Connectors USB-B-PTH is fully proven SKU : PRT-00139/CONN-08278 USB-miniB is fully proven SKU : PRT-00587 USB-A-PCB is untested. USB-A-H is throughly reviewed, but untested. Spark Fun Electronics SKU : PRT-00437 USB-B-SMT is throughly reviewed, but untested. Needs silkscreen touching up. USB-A-S has not been used/tested USB-MB-H has not been used/tested USB-MICROB has been used. CONN-09505
Y1 = SmartPrj:RESONATOR
Y2 = SmartPrj:CRYSTAL-3.2-2.5

## Net classes
0 default: clearance 0.254 mm
1 vcc: width 0.2 mm, drill 0.1 mm, clearance 0.01 mm
2 V_mot: width 1 mm, drill 0.1 mm, clearance 1 mm
3 def: width 0.254 mm, drill 0.025 mm, clearance 0.254 mm
6 0.600: width 0.6 mm, drill 0.6 mm, clearance 1 mm

## Board
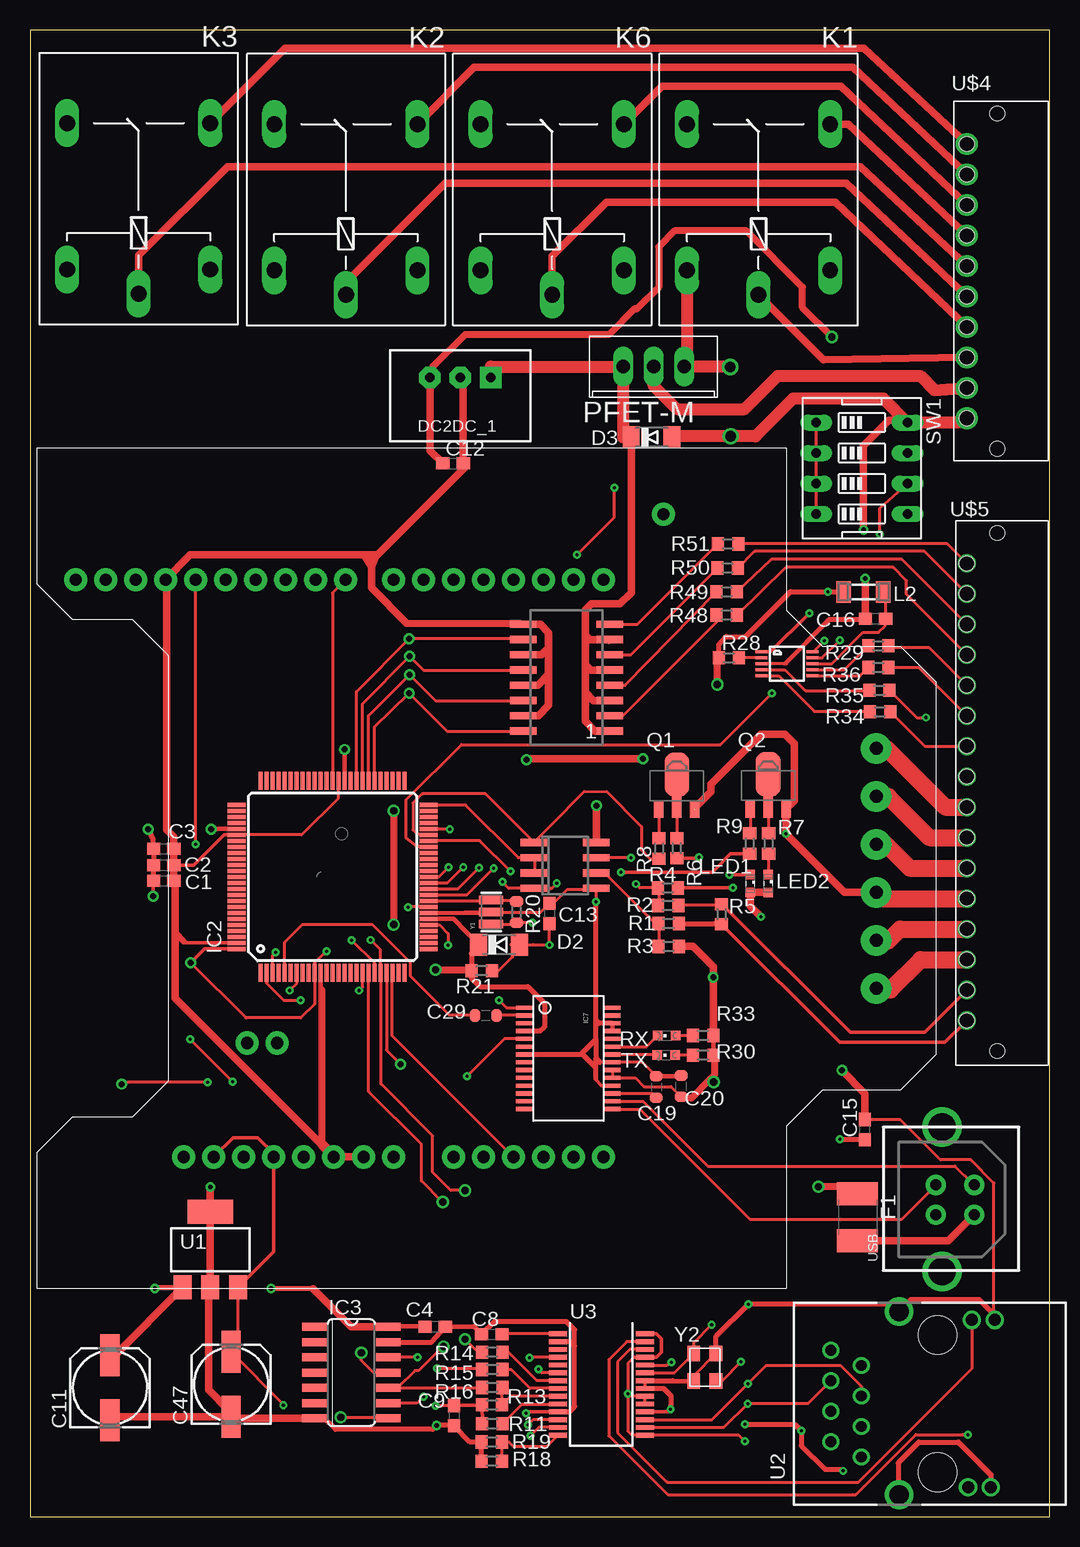
[diagram p5: board, top side]
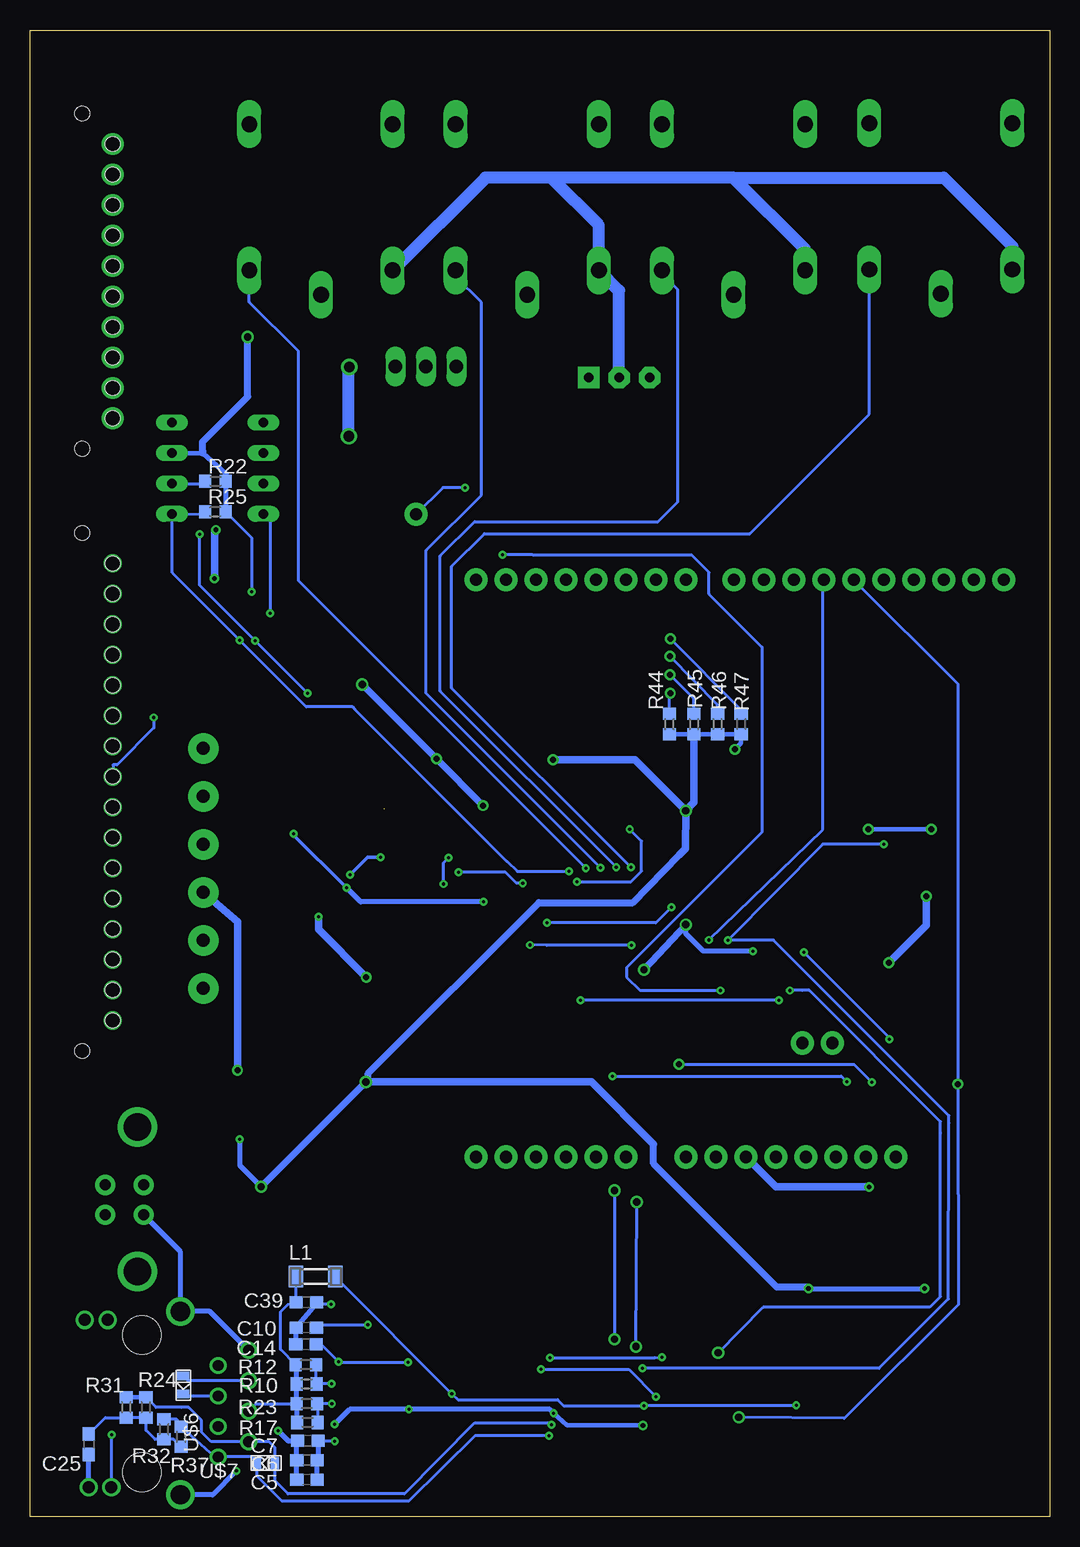
[diagram p6: board, bottom side, seen from below]

Size 85 x 123.88 mm. Coordinates in mm from the lower left corner, seen from the top.
Outline: 0,0 85,0 85,123.88 0,123.88 0,0
Copper layers (1+16): Top 0.035mm / dielectric 1.5mm / Bottom 0.035mm
Design rules "default *": minimum track width 10mil, minimum drill 24mil, track to track 6mil, track to pad 6mil, pad to pad 6mil, via to via 6mil, smd to smd 6mil, copper to edge 40mil, drill to drill 8mil, minimum pad ring 10mil, minimum via ring 8mil, stop-mask expansion 4mil, vias tented up to drill 0mil, thermal gap 10mil

### Footprints (pad centres in the part's own frame; a part is rotated, then mirrored left to right if it is on the bottom)
C0603 = smd 1.1 x 1: 1 -0.85,0; 2 0.85,0
153CLV-0605 = smd 3.5 x 1.6: + 2.7,0; - -2.7,0
C0603-ROUND = smd 0.898 x 1.1: 1 -0.889,0; 2 0.889,0
SOD80C = smd 1.4 x 1.8: A 1.7,0; C -1.7,0
MINIMELF = smd 1.4 x 1.8: A 1.7,0; C -1.7,0
TSR-1 = drill 0.8 pad 1.8 square: 1 -2.54,-1.5 | drill 0.8 pad 1.8 octagon: 2 0,-1.5; 3 2.54,-1.5
L1812 = smd 1.9 x 3.4: 1 -1.95,0; 2 1.95,0
TQFP100 = smd 1.5 x 0.35: 1 -8,6; 2 -8,5.5; 3 -8,5; 4 -8,4.5; 5 -8,4; 6 -8,3.5; 7 -8,3; 8 -8,2.5; 9 -8,2; 10 -8,1.5; 11 -8,1; 12 -8,0.5; 13 -8,0; 14 -8,-0.5; 15 -8,-1; 16 -8,-1.5; 17 -8,-2; 18 -8,-2.5; 19 -8,-3; 20 -8,-3.5; 21 -8,-4; 22 -8,-4.5; 23 -8,-5; 24 -8,-5.5; 25 -8,-6; 51 8,-6; 52 8,-5.5; 53 8,-5; 54 8,-4.5; 55 8,-4; 56 8,-3.5; 57 8,-3; 58 8,-2.5; 59 8,-2; 60 8,-1.5; 61 8,-1; 62 8,-0.5; 63 8,0; 64 8,0.5; 65 8,1; 66 8,1.5; 67 8,2; 68 8,2.5; 69 8,3; 70 8,3.5; 71 8,4; 72 8,4.5; 73 8,5; 74 8,5.5; 75 8,6 | smd 0.35 x 1.5: 26 -6,-8; 27 -5.5,-8; 28 -5,-8; 29 -4.5,-8; 30 -4,-8; 31 -3.5,-8; 32 -3,-8; 33 -2.5,-8; 34 -2,-8; 35 -1.5,-8; 36 -1,-8; 37 -0.5,-8; 38 0,-8; 39 0.5,-8; 40 1,-8; 41 1.5,-8; 42 2,-8; 43 2.5,-8; 44 3,-8; 45 3.5,-8; 46 4,-8; 47 4.5,-8; 48 5,-8; 49 5.5,-8; 50 6,-8; 76 6,8; 77 5.5,8; 78 5,8; 79 4.5,8; 80 4,8; 81 3.5,8; 82 3,8; 83 2.5,8; 84 2,8; 85 1.5,8; 86 1,8; 87 0.5,8; 88 0,8; 89 -0.5,8; 90 -1,8; 91 -1.5,8; 92 -2,8; 93 -2.5,8; 94 -3,8; 95 -3.5,8; 96 -4,8; 97 -4.5,8; 98 -5,8; 99 -5.5,8; 100 -6,8
SO14 = smd 0.66 x 2.032: 1 -3.81,-3.073; 2 -2.54,-3.073; 3 -1.27,-3.073; 4 0,-3.073; 5 1.27,-3.073; 6 2.54,-3.073; 7 3.81,-3.073; 8 3.81,3.073; 9 2.54,3.073; 10 1.27,3.073; 11 0,3.073; 12 -1.27,3.073; 13 -2.54,3.073; 14 -3.81,3.073
SSOP28DB = smd 0.348 x 1.397: 1 -4.225,-3.656; 2 -3.575,-3.656; 3 -2.925,-3.656; 4 -2.275,-3.656; 5 -1.625,-3.656; 6 -0.975,-3.656; 7 -0.325,-3.656; 8 0.325,-3.656; 9 0.975,-3.656; 10 1.625,-3.656; 11 2.275,-3.656; 12 2.925,-3.656; 13 3.575,-3.656; 14 4.225,-3.656; 15 4.225,3.656; 16 3.575,3.656; 17 2.925,3.656; 18 2.275,3.656; 19 1.625,3.656; 20 0.975,3.656; 21 0.325,3.656; 22 -0.325,3.656; 23 -0.975,3.656; 24 -1.625,3.656; 25 -2.275,3.656; 26 -2.925,3.656; 27 -3.575,3.656; 28 -4.225,3.656
SO-08 = smd 0.6 x 2.2: 1 -1.905,-2.6; 2 -0.635,-2.6; 3 0.635,-2.6; 4 1.905,-2.6; 5 1.905,2.6; 6 0.635,2.6; 7 -0.635,2.6; 8 -1.905,2.6
G5LE = drill 1.321 long: 1 -7.493,-5.969; 2 -7.493,5.969; O 4.699,5.969; P -9.525,0; S 4.699,-5.969
SM-1206 = smd 1.2 x 1.8: 1 -1.65,0; 2 1.65,0
LED_SML0603 = smd 0.8 x 0.8: A 0.75,0; C -0.75,0
SOP16 = smd 0.6 x 2.2: 1 -4.455,-3.6; 2 -3.185,-3.6; 3 -1.915,-3.6; 4 -0.645,-3.6; 5 0.625,-3.6; 6 1.895,-3.6; 7 3.165,-3.6; 8 4.435,-3.6; 9 4.435,3.6; 10 3.165,3.6; 11 1.895,3.6; 12 0.625,3.6; 13 -0.645,3.6; 14 -1.915,3.6; 15 -3.185,3.6; 16 -4.455,3.6
FQP47P06-NORMAL = drill 1.118 long: 1 2.54,-2.54; 2 5.08,-2.54; 3 7.62,-2.54
SOT89 = smd 0.8 x 1.4: 1 -1.499,-1.981; 3 1.499,-1.981 | smd 0.8 x 1.9: 2 0,-1.727 | smd 2.032 x 3.65: 2@1 0,0.94
R0603 = smd 1 x 1.1: 1 -0.85,0; 2 0.85,0
R0603-ROUND = smd 0.898 x 1.1: 1 -0.889,0; 2 0.889,0
CHIPLED_0603 = smd 0.8 x 0.8: A 0,-0.75; C 0,0.75
EDG-04 = drill 0.813 long: 1 -3.81,-3.81; 2 -1.27,-3.81; 3 1.27,-3.81; 4 3.81,-3.81; 5 3.81,3.81; 6 1.27,3.81; 7 -1.27,3.81; 8 -3.81,3.81
SOT223 = smd 1.5 x 2: 1 -3.57,-3.15; 2 -1.27,-3.15; 3 1.03,-3.15 | smd 3.8 x 2: 4 -1.27,3.15
5-6605758-1 = drill 0.9 pad 1.3: 1 -4.445,0; 2 -3.175,2.54; 3 -1.905,0; 4 -0.635,2.54; 5 0.635,0; 6 1.905,2.54; 7 3.175,0; 8 4.445,2.54 | drill 1 pad 1.422: D1 -6.973,-8.902; D2 -6.973,-10.807; D3 6.973,-9.219; D4 6.973,-11.124 | drill 1.6 pad 2.184: M1 7.683,-3.141; M2 -7.603,-3.141 | hole 3.2: 5.715,-6.35; -5.715,-6.35
SSOP28 = smd 0.4 x 1.5: 1 -4.225,-3.625; 2 -3.575,-3.625; 3 -2.925,-3.625; 4 -2.275,-3.625; 5 -1.625,-3.625; 6 -0.975,-3.625; 7 -0.325,-3.625; 8 0.325,-3.625; 9 0.975,-3.625; 10 1.625,-3.625; 11 2.275,-3.625; 12 2.925,-3.625; 13 3.575,-3.625; 14 4.225,-3.625; 15 4.225,3.625; 16 3.575,3.625; 17 2.925,3.625; 18 2.275,3.625; 19 1.625,3.625; 20 0.975,3.625; 21 0.325,3.625; 22 -0.325,3.625; 23 -0.975,3.625; 24 -1.625,3.625; 25 -2.275,3.625; 26 -2.925,3.625; 27 -3.575,3.625; 28 -4.225,3.625
MSOP10 = smd 0.25 x 1: 1 -1,-2.113; 2 -0.5,-2.113; 3 0,-2.113; 4 0.5,-2.113; 5 1,-2.113; 6 1,2.113; 7 0.5,2.113; 8 0,2.113; 9 -0.5,2.113; 10 -1,2.113
POWERSTEP1 = drill 1.016 pad 1.93: 3.3V 59.115,19.811; 5V 59.115,22.311; A0 59.115,34.811; A1 59.115,37.311; A2-CS 59.115,39.811; A3 59.115,42.311; A4 59.115,44.811; A5 59.115,47.311; AREF 11.015,8.311; CN3-1 49.615,17.611; CN3-2 49.615,20.111; D0 11.015,47.311; D1 11.015,44.811; D2-FLAG 11.015,42.311; D3 11.015,39.811; D4-BUSY 11.015,37.311; D5 11.015,34.811; D6 11.015,32.311; D7 11.015,29.811; D8-RESET 11.015,25.811; D9-STCK 11.015,23.311; D10 11.015,20.811; D11-MOSI 11.015,18.311; D12-MISO 11.015,15.811; D13-SCK 11.015,13.311; GND@1 59.115,24.811; GND@2 59.115,27.311; GND@3 11.015,10.811; IOREF 59.115,14.811; NC 59.115,12.311; RESET 59.115,17.311; SCL 11.015,3.311; SDA 11.015,5.811; SW 5.565,52.311; VIN 59.115,29.811 | drill 1.1 pad 2.54: A+ 45.065,70.061; A- 25.065,70.061; B+ 41.065,70.061; B- 29.065,70.061; GND@0 37.065,70.061; VS+ 33.065,70.061
10_R44 - 1821326 = drill 1.2 pad 1.676: P$2 -2.54,25.4; P$3 -2.54,22.86; P$4 -2.54,20.32; P$5 -2.54,17.78; P$6 -2.54,15.24; P$7 -2.54,12.7; P$8 -2.54,10.16; P$9 -2.54,7.62; P$10 -2.54,5.08; P$11 -2.54,2.54 | hole 1.2: -2.54,2.54; -2.54,5.08; -2.54,7.62; -2.54,10.16; -2.54,12.7; -2.54,15.24; -2.54,17.78; -2.54,20.32; -2.54,22.86; -2.54,25.4; 0,0; 0,27.94
16_R56 - 1821384 = drill 1: P$1 -2.539,2.542; P$2 -2.539,5.082; P$3 -2.539,7.622; P$4 -2.539,10.162; P$5 -2.539,12.702; P$6 -2.539,15.242; P$7 -2.539,17.782; P$8 -2.539,20.322; P$9 -2.539,22.862; P$10 -2.539,25.402; P$11 -2.539,27.942; P$12 -2.539,30.482; P$13 -2.539,33.022; P$14 -2.539,35.562; P$15 -2.539,38.102; P$16 -2.539,40.642 | hole 1.2: 0.001,0.002; -2.539,2.542; -2.539,5.082; -2.539,7.622; -2.539,10.162; -2.539,12.702; -2.539,15.242; -2.539,17.782; -2.539,20.322; -2.539,22.862; -2.539,25.402; -2.539,27.942; -2.539,30.482; -2.539,33.022; -2.539,35.562; -2.539,38.102; -2.539,40.642; 0.001,43.182
0402 = smd 0.7 x 1: A -0.5,0; C 1,0
USB-B-PTH-VERTICAL = drill 0.914 pad 1.676: D+ 4.826,4.394; D- 4.826,7.595; GND 7.315,4.394; VBUS 7.315,7.595 | drill 2.286: P$1 0,4.902; P$2 12.04,4.902
RESONATOR = smd 0.7 x 2: 1 -1,0; 2 0,0; 3 1,0
CRYSTAL-3.2-2.5 = smd 1.3 x 1.05: 1 -1.15,-0.925; 2 1.15,-0.925; 3 1.15,0.925; 4 -1.15,0.925

### Placement (x,y rotation side)
C1  11.15,52.98 0 top
C2  11.15,54.28 0 top
C3  11.15,55.64 0 top
C4  33.78,15.83 0 top
C5  61.9,3.07 180 bottom
C6  61.9,4.69 180 bottom
C7  61.83,6.31 180 bottom
C8  38.5,15.2 0 top
C9  35.35,8.41 270 top
C10  61.97,15.73 180 bottom
C11  6.67,10.74 90 top
C12  35.27,87.76 0 top
C13  43.3,50.25 270 top
C14  61.99,14.35 180 bottom
C15  69.61,32.24 90 top
C16  70.49,74.81 180 top
C19  52.21,35.8 270 top
C20  54.29,35.86 90 top
C25  80.1,6.02 270 bottom
C29  38.01,41.74 180 top
C39  61.96,17.87 0 bottom
C47  16.78,11.02 90 top
D2  39.1,47.65 0 top
D3  51.83,89.94 0 top
DC2DC_1  35.88,93.41 180 top
F1  68.99,24.94 270 top
IC2  25.22,53.3 90 top
IC3  26.79,12 270 top
IC7  44.89,38.18 270 top
IC8  44.61,54.26 270 top
K1  60.74,111.34 90 top
K2  26.34,111.34 90 top
K3  9.06,111.42 90 top
K6  43.54,111.34 90 top
L1  61.18,19.99 0 bottom
L2  69.49,77.06 180 top
LED1  60.06,52.74 270 top
LED2  61.53,52.76 270 top
OC1  44.74,69.92 90 top
PFET-M  57.07,93.29 180 top
Q1  53.93,60.92 0 top
Q2  61.54,60.92 0 top
R1  53.24,49.42 0 top
R2  53.2,50.92 0 top
R3  53.25,47.51 0 top
R4  53.19,52.39 180 top
R5  57.65,50.2 270 top
R6  53.93,55.69 270 top
R7  61.58,56.09 270 top
R8  52.44,55.67 270 top
R9  60.01,56.09 270 top
R10  61.94,11.05 180 bottom
R11  38.54,7.74 180 top
R12  61.99,12.66 180 bottom
R13  38.52,9.32 180 top
R14  38.53,13.7 180 top
R15  38.55,12.26 180 top
R16  38.54,10.76 180 top
R17  61.87,7.85 180 bottom
R18  38.52,4.62 0 top
R19  38.5,6.21 0 top
R20  40.56,50.36 270 top
R21  37.65,45.49 180 top
R22  69.54,86.27 0 bottom
R23  61.91,9.41 180 bottom
R24  75.34,9.1 90 bottom
R25  69.55,83.74 0 bottom
R28  58.27,71.56 0 top
R29  70.73,72.56 0 top
R30  56.12,38.45 180 top
R31  76.97,9.1 90 bottom
R32  73.83,7.28 90 bottom
R33  56.11,40.09 180 top
R34  70.87,67.06 0 top
R35  70.81,68.85 0 top
R36  70.73,70.75 180 top
R37  72.4,6.65 90 bottom
R44  31.7,66.04 270 bottom
R45  29.64,66.03 270 bottom
R46  27.67,66.04 270 bottom
R47  25.7,66.04 270 bottom
R48  58.09,75.12 180 top
R49  58.08,77.07 180 top
R50  58.17,79.04 180 top
R51  58.19,81.05 180 top
RX  53.07,40.08 90 top
SW1  69.35,87.36 270 top
TX  53.05,38.46 90 top
U1  16.31,22.24 0 top
U2  69.31,9.41 90 top
U3  47.64,11 270 top
U$1  63.11,71.07 270 top
U$2  0.49,89.08 270 top
U$4  80.64,88.98 0 top
U$5  80.64,38.8 0 top
U$6  72.22,11.21 270 bottom
U$7  65.07,4.46 180 bottom
USB  71.14,32.46 270 top
Y1  38.45,50.36 90 top
Y2  56.26,12.44 90 top

### Tracks (layer width: path | path; a pad name or v marks a point on that pad's centre or on a via)
3.3V  (via drill 0.25)
  Top 0.254: U3.19 U3.20 50.05,10.03 v49.84,10.24 | v59.59,6.28 59.09,6.78 U3.15 50.18,6.78 49.84,7.12 v49.84,10.24 | U3.28 | v33.82,9.25 v33.82,9.26 C9.1 | U3.25 50.36,13.28 49.85,12.77 49.85,10.25 v49.84,10.24 | 16.55,13.69 C47.+ | C47.+ 17.34,14.28 U1.3 | C47.+ 21.12,9.38
  Top 0.305: U3.19 51.28,9.4 | C9.1 37.71,9.26 R13.2 37.72,7.76 R11.2 | U1.3 20.31,22.06 U$2.3.3V 20.31,30.26 18.98,31.59 16.93,31.59 U$2.IOREF | 21.12,9.38 v21.12,9.27 | U3.28 | U3.28 52.25,15.23 52.65,14.82 52.65,13.7 52.23,13.28 U3.25
  Bottom 0.254: v59.59,6.28 60.95,6.28 C7.1 | L1.2 59.53,19.94 v49.84,10.24 49.33,9.74 41.01,9.74 40.52,9.25 v33.82,9.25 21.14,9.25 | C6.1
  Bottom 0.305: v21.12,9.27 21.14,9.25
  Bottom 0.406: C5.1 | C5.1 C6.1 60.98,4.77 C7.1
12V
  Top 0.61: 46.3,68.69 46.3,71 | 46.3,68.69 46.3,66.27 47.12,65.46 OC1.1 | 46.3,71 46.3,72.07 46.32,72.08 46.32,73.46 | 48.29,73.03 OC1.7 46.7,73.08 46.32,73.46 | 46.3,71 46.76,70.54 OC1.5 | 46.3,68.69 46.99,68 OC1.3 | D3.C 50.13,79.18 50.13,79.17 50.14,76.97 49.19,76.06 46.8,76.06 46.32,75.58 46.32,73.46
  Top 1.016: D3.C 49.45,89.94 PFET-M.3 38.42,95.83 DC2DC_1.1
12V_IN
  Top 1.016: 77.42,93.95 U$4.P$10 75.4,93.88 74.22,95.05 62.33,95.05 59.57,92.29 53.95,92.29 51.99,94.24 PFET-M.2
+3V3
  Top 0.254: IC7.17 51.87,35.26 C19.2
A
  Top 0.305: R5.2 67.51,39.51 75.56,39.51 | 75.56,39.51 76.08,39.51 | U$5.P$1 76.28,39.51 75.56,39.51
  Top 0.406: R1.2 57.08,49.42 R5.2
A0_ADC  (via drill 0.25)
  Top 0.254: v74.67,66.59 73.92,66.59 R35.2
  Bottom 0.254: v74.67,66.59 74.67,65.72 77.74,62.65 78.07,62.65 U$5.P$9
A1_ADC
  Top 0.254: R34.2 74.58,64.2 U$5.P$10
A2_ADC
  Top 0.254: U$5.P$11 74.09,70.75 R36.1
A3_ADC
  Top 0.254: R29.2 71.74,72.4 74.98,72.4 U$5.P$12
A+_STEP
  Top 1.422: U$2.A+ 70.67,43.9 71.75,43.9 74.27,46.42 U$5.P$3
A-_STEP
  Top 1.422: U$2.A- 70.59,63.98 71.45,63.98 76.31,59.12 U$5.P$8
B
  Top 0.254: R2.2 54.05,50.95 57.1,50.95 R5.1
  Top 0.305: R5.1 57.2,51 57.74,51 68.38,40.36 73.02,40.38 | 73.02,40.38 73.6,40.38 | U$5.P$2 74.6,40.38 73.02,40.38
B+_STEP
  Top 1.422: U$2.B+ 70.62,47.95 71.52,47.95 72.53,48.96 U$5.P$4
B-_STEP
  Top 1.422: U$2.B- 70.58,59.99 71.56,59.99 74.98,56.58 U$5.P$7
CCW  (via drill 0.25)
  Top 0.254: v27.43,43.84 27.74,44.15 27.74,45.26 IC2.18 | v45.61,80.15 48.72,83.27 v48.72,85.75
  Bottom 0.254: v27.43,43.84 34.14,43.84 35.26,44.96 35.26,45.75 23.98,57.03 23.98,72.46 28.38,76.87 28.38,78.69 29.82,80.12 43.1,80.12 43.13,80.15 v45.61,80.15 | v48.72,85.75 50.58,85.75 U$2.SW
COMM_1
  Top 0.61: K1.P 66.14,96.42 U$4.P$9
COMM_2
  Top 0.61: K6.P 43.54,105.01 48.05,109.52 67.15,109.52 U$4.P$8
COMM_3
  Top 0.61: K2.P 26.34,102.84 34.62,111.12 67.37,111.12 67.86,111.12 68.08,111.12 U$4.P$7
COMM_4
  Top 0.61: K3.P 9.06,105.1 16.46,112.5 68.49,112.5 69.02,112.5 69.24,112.5 U$4.P$6
CS  (via drill 0.61)
  Top 0.254: 37.67,10.78 R16.2 37.66,10.73 30.66,10.73 | 30.66,10.73 IC3.10 | IC2.19 28.25,45.26 28.25,35.41 32.64,31.01 32.64,27.98 v34.41,26.21 | v34.48,14.16 34.31,14.07 32.39,12.16 32.08,12.16 30.66,10.73
  Bottom 0.254: v34.48,14.16 v34.41,26.21
CS_M
  Top 0.254: IC2.23 30.18,45.26 30.18,40.08 40.23,30.02 U$2.A2-CS
D1  (via drill 0.5)
  Top 0.254: IC2.56 28.72,65.8 v31.62,68.61 34.77,65.46 OC1.16
  Bottom 0.254: R44.1 31.7,68.75 v31.62,68.61
D2  (via drill 0.5)
  Top 0.254: IC2.57 28.22,66.74 v31.64,70.17 33.81,68 OC1.14
  Bottom 0.254: R45.1 29.64,68.16 v31.64,70.17
D3  (via drill 0.5)
  Top 0.254: IC2.58 27.72,67.72 v31.65,71.68 32.8,70.54 OC1.12
  Bottom 0.254: R46.1 27.67,67.67 v31.65,71.68
D4  (via drill 0.5)
  Top 0.254: IC2.59 27.22,68.75 v31.61,73.14 41.08,73.14 OC1.10
  Bottom 0.254: R47.1 25.72,67.25 v31.61,73.14
D+
  Top 0.254: IC7.15 48.57,33.88 50.9,33.88 60.05,24.74 72.64,24.74 75.49,27.58 USB.D+
D-
  Top 0.254: IC7.16 48.57,34.59 51.12,34.59 56.5,29.21 77.11,29.21 78.64,27.69 USB.D-
DIG1_48V
  Top 0.61: U$4.P$5 68.24,116.04 K1.S
DIG2_48V
  Top 0.61: K6.S 52.68,119.21 67.61,119.21 U$4.P$4
DIG3_48V
  Top 0.61: K2.S 37.03,120.76 67.69,120.76 68.39,120.76 68.61,120.76 U$4.P$3
DIG4_48V
  Top 0.61: K3.S 21.27,122.36 69.54,122.36 U$4.P$2 77.49,114.31
DIG_24V_IN_1
  Top 0.254: R48.1 63.03,79.11 71.97,79.11 73.07,78 73.07,76.85 U$5.P$13
DIG_24V_IN_2
  Top 0.254: R49.1 61.83,79.79 72.67,79.79 U$5.P$14
DIG_24V_IN_3
  Top 0.254: R50.1 60.41,80.44 74.57,80.44 U$5.P$15
DIG_24V_IN_4
  Top 0.254: R51.1 76.49,81.05 U$5.P$16
DTR
  Top 0.254: IC7.2 38.91,41.76 C29.1
GND  (via drill 0.25, 0.38, 0.5, 0.9)  (1 unrouted)
  Top 0.254: Y2.4 55.34,11.74 Y2.2 | C19.1 51.05,37.86 IC7.21 47.51,37.86 | 62.83,71.07 U$1.3 | 66.46,74.69 62.83,71.07 | 66.46,74.69 66.59,74.82 69.26,74.82 | 69.26,74.82 69.61,74.82 C16.2 | C16.2 69.27,74.82 69.26,74.82 | C16.2 arc-90 69.49,74.69 66.7,74.69 | 66.7,74.69 66.46,74.69 | 62.83,71.07 63.07,71.07 66.7,74.69 | Y1.2 42.56,50.37 C13.1 43.38,51.16 43.69,51.16 44.81,52.27 47.14,52.27 IC8.5 | 41.25,38.56 IC7.7 | 47.14,52.17 IC8.5 | 55.68,58.98 55.47,58.98 | 62.99,58.98 Q2.3 63.09,58.88 | 69.6,33.17 C15.2 69.7,33.07 72.54,33.07 75.9,29.72 78.44,29.72 80.37,27.79 80.37,16.41 U2.D4 | 70.21,51.36 U$2.GND@0 | 54.05,52.38 R4.1 | 28.93,80.13 28.89,80.16 | 36.19,87.34 36.17,87.53 C12.2 | 40.84,74.42 OC1.9 | C1.2 12.09,52.88 | 11.99,54.2 C2.2 11.99,54.41 | 11.99,55.63 C3.2 11.99,55.73 | 11.38,77.98 U$2.GND@3 11.28,78.04 | IC2.81 22.64,56.8 25.71,59.87 IC2.62 | IC8.5 v47.21,51.23 v47.2,51.22 47.18,51.2 | 48.53,35.89 IC7.18
  Top 0.305: U3.22 U3.21 | U3.11 41.23,8.73 v41.34,8.61 | R4.1 56.48,52.39 v58.62,52.4 | 63.02,58.92 Q2.3 | IC2.81 16.17,56.8 13.66,54.28 C2.2 | IC2.99 13.06,47.8 | 13.06,47.8 12.76,47.8 12.09,48.47 | 13.06,47.8 12.09,48.88 | U3.18 53.21,8.73 v53.41,8.94 | IC7.18 47.66,35.92 47.18,36.4 47.18,36.49
  Top 0.356: IC2.32 36.22,50.3 37.63,50.32 38.43,50.35 Y1.2 | IC7.25 IC7.26 | C19.1 54.23,36.69 C20.2 | 24.22,44.13 24.22,31.45 | 24.22,44.13 IC2.11 | 24.22,31.45 24.22,31.05 24.3,30.97 25.1,30.18 U$2.GND@1 25.31,30.36 24.45,31.22 | 24.45,31.22 24.22,31.45 | 24.45,31.22 24.45,43.9 24.22,44.13
  Top 0.406: U3.22 53.58,11.32 Y2.4 | U3.21 52.82,10.68 53.44,10.05 53.44,9.3 v53.41,8.94 | Y2.2 57.19,15.01 v59.9,17.7 71.87,17.7 U2.M1 73.43,18.07 79.14,18.07 80.43,16.78 U2.D4 | U2.M2 72.39,1.87 72.39,4.47 74.09,6.2 77.41,6.21 80.12,3.5 U2.D2 | U3.2 45.03,14.58 45.4,14.21 | U3.11 44.97,8.73 45.4,9.16 45.4,14.21 | R18.1 37.67,6.26 R19.1 36.69,6.21 C9.2 35.31,7.59 v33.9,7.59 33.57,7.27 25.46,7.27 24.54,8.19 IC3.7 | C8.1 37.65,15.46 | C8.1 37.01,15.84 C4.2 33.49,14.54 IC3.13 | 45.4,14.21 45.4,15.57 44.94,16.04 44.93,16.04 44.71,16.25 38.71,16.25 C8.1 | v59.61,7.68 63.77,7.68 v64.3,7.14 64.3,5.92 66.3,3.93 67.67,3.93 v67.79,3.8 | IC7.26 47.42,41.11 47.18,41.35 | 47.18,41.35 47.18,51.2 | 47.18,39.76 47.18,38.19 | 47.18,39.76 47.18,41.35 | 47.18,37.4 47.18,38.19 | 47.18,36.49 47.18,37.4 | 47.51,37.86 47.18,38.19 | IC7.7 45.93,38.51 | 45.93,38.51 47.18,39.76 | 45.93,38.51 46.08,38.51 47.18,37.4 | 27.95,80.16 27.93,80.05 | 25.1,29.97 U$2.GND@1 | 25.1,29.97 25.1,30.18 | 24.3,30.8 24.3,30.97 | 24.3,30.8 24.3,30.76 25.1,29.97 | 24.22,31.05 24.22,30.88 24.3,30.8
  Top 0.61: C47.- 16.65,8.19 IC3.7 | C11.- 6.94,8.3 C47.- | C47.- 16.54,8.92 14.89,10.57 14.89,18.94 U1.2 U1.4 v15.04,27.47 v15.03,27.48 | U$2.GND@2 U$2.GND@1 | C16.2 69.64,78.07 v69.61,78.18 | v69.48,82.23 69.48,89.22 71.62,91.36 73.11,91.36 SW1.8 | 77.05,91.39 U$4.P$11 | C12.2 36.12,94.67 DC2DC_1.2 | OC1.15 42.39,66.73 43.25,67.59 43.25,70.17 | 43.25,72.42 43.25,70.17 | 43.25,72.42 43.25,73.67 42.56,74.36 OC1.9 | OC1.13 42.35,69.27 43.25,70.17 | OC1.11 42.64,71.81 43.25,72.42 | 40.84,74.42 31.41,74.44 28.46,77.38 28.46,79.15 | 28.46,79.15 28.89,80.16 27.95,80.16 13.35,80.17 11.28,78.04 | 36.19,87.34 28.93,80.13 | 11.99,54.2 C1.2 | 11.99,54.41 11.99,55.63 | 11.38,77.98 11.38,57.25 11.99,56.64 11.99,55.73 | 63.02,58.92 v63.02,56.89 67.89,52.02 U$2.GND@0 | C15.2 69.6,35.24 v67.7,37.19 | Q1.3 55.43,59.06 56.77,60.4 56.77,61.03 60.95,65.2 62.92,65.2 63.73,64.39 63.73,59.63 Q2.3 | 24.22,31.05 12.09,43.18 12.09,48.47 12.09,48.88 12.09,52.88 | 27.93,80.05 28.46,79.15
  Top 1.016: K1.2 54.77,95.83 PFET-M.1 58.38,95.83 v58.38,95.8 | D3.A 53.53,90.02 v58.42,90.02 60.49,90.02 63.62,93.15 71.17,93.15 SW1.8 77.32,91.17 U$4.P$11
  Top 1.422: U$2.GND@0 71.08,51.5 U$5.P$5
  Bottom 0.254: v59.9,17.7 61.12,17.7 C39.2
  Bottom 0.305: v58.62,52.4 58.66,52.43 63.09,56.86 63.04,56.86 v63.02,56.89
  Bottom 0.356: v41.34,8.61 40.22,7.59 v33.9,7.59
  Bottom 0.406: C5.2 C6.2 | C6.2 | C6.2 62.75,6.24 C7.2 63.48,6.31 v64.3,7.14 | U2.D2 80.12,3.98 C25.2 | U2.8 70.01,17.09 U2.M1 72.45,22.06 USB.GND | C14.2 62.82,14.37 C10.2 61.16,17.69 C39.2 | U2.D4 80.43,16.93 | v67.79,3.8 69.78,1.81 U2.M2 | v47.2,51.22 57.43,51.22 v58.62,52.4 | v59.61,7.68 58.35,8.94 v53.41,8.94 41.67,8.94 v41.34,8.61
  Bottom 0.61: v15.03,27.48 22.81,27.48 U$2.GND@1 | v69.61,78.18 69.59,82.12 v69.48,82.23 | v67.7,37.19 67.68,49.56 U$2.GND@0
  Bottom 1.016: v58.42,90.02 58.42,95.8 v58.38,95.8 | K1.2 47.04,111.58 41.55,111.58 | 26.38,111.58 41.55,111.58 | 26.38,111.58 8.83,111.58 3.09,105.84 K3.2 | 41.55,111.58 37.57,107.6 K6.2 35.88,102.16 DC2DC_1.2 | K2.2 20.37,105.57 26.38,111.58
INT  (via drill 0.25, 0.61)
  Top 0.254: v21.64,43.84 22.25,44.45 22.25,45.26 IC2.7 | 29.26,12.04 29.77,12.04 IC3.11 28.65,12 27.61,13.04 v27.61,13.64 v27.62,13.64
  Bottom 0.254: v21.64,43.84 20.63,43.84 20.62,43.84 20.03,43.84 9.1,32.91 9.1,31.98 9.1,18.34 10,17.45 10.12,17.45 23.88,17.42 v27.62,13.64
INT_3V3  (via drill 0.25)
  Top 0.254: U3.4 41.68,13.28 v41.65,13.25 | v32.33,13.28 IC3.12
  Bottom 0.254: v41.65,13.25 32.91,13.25 v32.33,13.28
LED1  (via drill 0.25)
  Top 0.254: U3.27 49.76,14.58 48.26,13.08 48.26,6.73 53.17,1.82 68.59,1.82 68.59,1.83 68.84,1.83 73.85,6.83 v78.2,6.83 77.73,6.83
  Bottom 0.254: U2.D1 78.2,2.92 v78.2,6.83
LED2
  Top 0.254: U3.26 50.03,13.93 49,12.89 49,6.99 53.11,2.87 69.07,2.87 78.55,12.35 78.55,16.36 U2.D3
MISO_1  (via drill 0.25, 0.5, 0.61)
  Top 0.254: v25.91,8.28 29.77,8.28 IC3.8 | IC2.22 29.72,38.86 v30.89,37.69 | v14.81,36.19 8.23,36.19 v7.65,36.05
  Bottom 0.254: v25.91,8.28 17.12,8.19 7.62,17.65 v7.65,36.05 7.65,69.4 16.26,77.98 U$2.D12-MISO | v30.89,37.69 16.31,37.69 v14.81,36.19
MOSI_1  (via drill 0.25, 0.61)
  Top 0.254: v36.27,14.78 37.29,13.77 37.59,13.77 R14.2 | IC2.21 29.26,45.26 29.26,36.05 33.58,31.73 33.58,28.68 35.08,27.18 v36.27,27.18 | 29.26,45.36 IC2.21 | IC2.21 29.22,47.24 v28.41,48.05
  Bottom 0.254: v36.27,27.18 v36.27,14.78 | v28.41,48.05 18.9,57.25 18.9,77.98 U$2.D11-MOSI
N$1
  Top 0.254: R3.1 52.43,47.9 52.43,49.33 R1.1 52.32,49.53 52.02,49.53 47.96,53.59 47.24,53.59 IC8.6
N$2  (via drill 0.25)
  Top 0.254: R2.1 52.43,50.95 52.43,52.38 R4.2 50.84,52.39 v50.51,52.71 | v50.11,54.9 IC8.7
  Bottom 0.254: v50.51,52.71 50.51,54.5 v50.11,54.9
N$3
  Top 0.254: R30.2 TX.A
N$4  (via drill 0.25)
  Top 0.254: SW1.1 SW1.2 SW1.3 SW1.4
  Top 0.305: U$1.1 61.74,72.07 v64.99,75.27
  Bottom 0.254: SW1.4 64.99,83 v64.99,75.27
  Bottom 0.305: 65.57,83.52 SW1.4
N$5  (via drill 0.25)
  Top 0.305: LED1.C v58.3,53.49 | R6.2 55.65,54.84 v55.77,54.96
  Bottom 0.305: v55.77,54.96 56.84,54.96 v58.3,53.49
N$6
  Top 0.254: LED2.C 61.57,53.59 61.57,55.22 R7.2
N$7
  Top 0.254: R6.1 53.95,56.54 53.95,59.18 Q1.2
N$8
  Top 0.254: R7.1 61.57,59.18 Q2.2
N$9
  Top 0.254: R9.1 60.05,56.95 60.05,58.88 Q2.1
N$10
  Top 0.254: R8.1 52.43,56.54 52.43,58.88 Q1.1
N$11
  Top 0.254: R11.1 41.04,9.38 U3.10
N$12
  Top 0.254: U3.9 40.08,10.03 R13.1 39.37,10.74 R16.1
N$13
  Top 0.254: U3.7 42.25,11.33 39.89,13.69 39.4,13.69 R14.1
N$14
  Top 0.254: R19.2 39.55,6.21 | R18.2 39.35,4.64 R19.2 | R19.2 39.94,6.21 40.32,5.83 43.07,5.83 U3.14
N$15
  Top 0.254: U3.8 41.69,10.68 40.14,12.22 39.44,12.22 R15.1
N$16
  Top 0.254: U3.1 39.38,15.23 C8.2
N$17  (via drill 0.25)
  Top 0.254: IC2.30 34.14,49.3 34.86,48.58 v34.86,47.6 | D2.A 40.09,47.65 | C13.2 43.32,49.3 v43.32,47.63 41.95,47.65 D2.A | R21.1 39.08,45.49 40.24,46.65 40.24,47.61 D2.A
  Bottom 0.254: v34.86,47.6 41.9,47.6 v43.32,47.63
N$18
  Top 0.254: U$1.5 62.42,70.07 65.39,67.1 69.99,67.1 R34.1
N$20
  Top 0.254: U$1.4 62.93,70.57 64.66,68.84 69.95,68.84 R35.1
N$21  (via drill 0.25)
  Top 0.254: U3.23 53.72,11.98 Y2.3 55.34,14.5 v56.83,15.99
  Bottom 0.254: 56.86,16.02 v56.83,15.99 60.86,15.99 C10.1
N$22
  Bottom 0.254: 72.14,5.8 R37.1 73.02,6.43 R32.1 74.58,6.43 75.33,7.18 R24.1 R31.1 78.72,8.25 C25.1
N$23
  Bottom 0.254: R12.2 64.13,13.94 64.13,17.05 63.49,17.69 C39.1 62.83,17.69 L1.1 | U2.4 66.14,9.41 R23.2
  Bottom 0.406: R17.2 62.72,9.36 R23.2 62.76,11.03 R10.2 62.79,12.6 R12.2
N$24
  Top 0.254: U$1.7 67.89,70.57 R29.1
N$25  (via drill 0.25)
  Top 0.254: U3.24 53.08,12.63 53.32,12.87 v53.49,12.87 | v59.27,12.88 57.68,11.29 Y2.1
  Bottom 0.254: v53.49,12.87 59.24,12.85 v59.27,12.88 60.73,14.35 C14.1
N$26
  Top 0.254: U$1.2 59.13,71.57 R28.2
N$27
  Top 0.254: U$1.6 69.19,70.07 R36.2
N$28
  Top 0.254: R33.2 RX.A
N$29
  Top 0.254: OC1.4 49.61,69.27 R49.2
N$30
  Top 0.254: OC1.8 50.64,74.35 R51.2
N$31
  Top 0.254: OC1.6 50.09,71.81 R50.2
N$32
  Top 0.254: R48.2 57.27,74.56 49.44,66.72 OC1.2
RE/DE_MAX
  Top 0.254: 41.45,54.91 41.96,54.91 IC8.2 | IC2.50 33.22,59.28 36.33,59.28 40.71,54.9 IC8.2 | IC8.3 42.06,53.7 42.06,54.81 IC8.2
RELAY_1_IN  (via drill 0.25)
  Top 0.254: IC2.35 36.43,51.8 v38.66,54.04
  Bottom 0.254: v38.66,54.04 62.62,77.99 62.62,97.12 66.71,101.21 K1.1
RELAY_2_IN  (via drill 0.25)
  Top 0.254: IC2.36 35.67,52.3 v37.43,54.07
  Bottom 0.254: v37.43,54.07 51.97,68.61 51.97,80.51 47.36,85.12 47.36,101.17 49.51,103.32 K6.1
RELAY_3_IN  (via drill 0.25)
  Top 0.254: IC2.37 34.81,52.8 v36.12,54.12
  Bottom 0.254: v36.12,54.12 50.8,68.79 50.8,80.06 47.94,82.92 32.65,82.89 31,84.56 30.99,84.59 30.99,102.25 32.31,103.57 K2.1
RELAY_4_IN  (via drill 0.25)
  Top 0.254: IC2.38 34.1,53.3 v34.9,54.1
  Bottom 0.254: v34.9,54.1 49.84,69.04 49.84,79.18 47.12,81.9 24.99,81.9 15.03,91.86 K3.1
RESET_1
  Top 0.254: U$2.D8-RESET 25.22,76.98 IC2.63
RESET_FTDI
  Top 0.254: C29.2 37.29,41.81 34.95,41.81 31.7,45.06 31.7,46.18 28.53,49.34 22.73,49.34 21.23,47.85 21.23,45.36 IC2.5
RX_FTDI  (via drill 0.25)
  Top 0.254: v39.12,43.03 39.73,42.42 41.15,42.42 IC7.1 | v22.56,43.03 21.13,43.03 19.71,44.45 19.71,45.26 IC2.2
  Bottom 0.254: v22.56,43.03 v39.12,43.03
RX_MAX
  Top 0.254: 52.43,54.91 R8.2 52.42,54.84 51.69,54.84 50.98,55.55 50.99,57.49 48.06,60.43 46.21,60.42 43.49,57.66 42.06,56.24 IC8.1 41.96,56.24 37.96,60.23 32.7,60.23 32.76,60.23 32.67,60.23 31.93,59.48 31.94,57.22 32.31,56.84 33.12,56.84 IC2.45
RXL
  Top 0.254: IC7.23 51.4,39.16 RX.C
SCK_1  (via drill 0.25)
  Top 0.254: v33.93,12.34 37.69,12.34 R15.2 | IC2.20 28.75,45.36 28.75,46.09 v26.82,48.03 | v13.82,56.03 13.82,77.98 U$2.D13-SCK
  Bottom 0.254: v13.82,56.03 18.9,56.03 v26.82,48.03 23.64,48.04 23.63,48.03 23,48.04 8.38,33.42 8.38,32.8 8.43,18.14 14.22,12.34 v33.93,12.34
SCL_ADC  (via drill 0.25)
  Top 0.254: U$1.10 65.31,72.07 v66.24,73 | v70.84,81.88 70.84,84.01 SW1.6 | IC2.43 33.12,55.83 32.31,55.83 31.35,56.58 31.33,59.72 35.96,64.33 57.55,64.34 61.77,68.53 v61.85,68.59
  Bottom 0.254: SW1.6 70.43,86.08 R22.1 | v70.84,81.88 70.84,77.6 v66.24,73 66.24,72.98 v61.85,68.59
SDA_ADC  (via drill 0.25)
  Top 0.254: U$1.9 66.04,71.57 v67.51,73.04 | v40.06,53.77 37.49,56.34 33.22,56.34 IC2.44
  Bottom 0.254: R25.1 70.4,83.55 SW1.5 73.14,78.67 v67.51,73.04 67.51,73.01 61.98,67.49 61.94,67.47 58.12,67.47 57.88,67.23 45.26,54.61 45.21,54.61 44.37,53.77 v40.06,53.77
SO_3V3  (via drill 0.25)
  Top 0.254: U3.6 42.67,11.98 v42.39,12.27 | v32.83,9.99 32.26,9.46 IC3.9
  Bottom 0.254: v42.39,12.27 35.07,12.27 v32.83,9.99
TPIN+  (via drill 0.25)
  Top 0.254: U3.13 42.44,7.43 v41.74,6.73
  Bottom 0.254: v41.74,6.73 47.9,6.73 53.44,1.29 64,1.29 66.07,3.37 66.1,4.43 U$7.C 66.58,4.97 U2.1 69.61,4.97 R37.2 72.14,7.5 72.77,8.13 R32.2
TPIN-  (via drill 0.25)
  Top 0.254: U3.12 41.94,8.08 v41.51,7.64
  Bottom 0.254: R24.2 74.49,9.1 72.36,9.1 72.35,9.1 71.78,9.1 70.7,8.02 70.7,7.04 69.89,6.24 U2.2 66.75,6.25 65.08,6.25 64.57,5.75 U$7.A 64.56,4.45 64.56,2.97 63.49,1.89 53.77,1.89 47.92,7.81 41.67,7.81 v41.51,7.64
  Bottom 0.356: R24.2 R31.2
TPOUT+  (via drill 0.25)
  Top 0.254: U3.17 56.87,8.08 v59.85,11.05 61.38,12.59 67.57,12.59 69.31,10.85 U2.5
  Bottom 0.254: R12.1 61.14,11.11 R10.1 v59.85,11.05 | U2.5 72.05,10.05 U$6.C
TPOUT-  (via drill 0.25)
  Top 0.254: U3.16 57.85,7.43 v59.84,9.41 64.86,9.41 U2.6
  Bottom 0.254: R17.1 61.02,9.36 R23.1 v59.84,9.41 | U2.6 71.82,11.32 U$6.A
TX_FTDI  (via drill 0.25)
  Top 0.254: IC2.3 20.22,46.75 v20.48,47.01 | IC7.5 39.55,39.81 v36.44,36.7 | v16.88,36.22 16.88,36.25 v13.36,39.78
  Bottom 0.254: v36.44,36.7 17.36,36.7 v16.88,36.22 | v20.48,47.01 13.36,39.89 v13.36,39.78
TX_MAX  (via drill 0.25)
  Top 0.254: R9.2 59.94,55.22 | v39.39,52.89 39.92,52.36 IC8.4 42.06,52.38 43.51,52.38 v43.92,52.79 | v35,57.28 33.24,57.28 IC2.46
  Top 0.305: 59.94,55.22 58.41,55.22 57.19,54.01 56.88,53.69 v49.28,53.69
  Bottom 0.254: v39.39,52.89 34.9,52.89 34,53.79 34,56.28 v35,57.28 | v43.92,52.79 44.44,52.79 45.35,53.69 v49.28,53.69
TXL
  Top 0.254: IC7.22 52.25,38.51 TX.C
VCC  (via drill 0.25, 0.38, 0.5, 0.61)
  Top 0.254: IC7.20 IC7.19 50.47,36.56 51.2,35.82 53.44,35.82 C20.1 | v24.75,47.12 24.53,46.9 24.48,46.9 23.72,46.15 IC2.10 23.72,42.71 22.56,41.55 18.01,41.55 v13.4,46.16
  Top 0.305: IC2.100 14.54,47.3 v13.4,46.16 | v10.28,51.7 10.28,52.96 C1.1
  Top 0.356: IC2.61 v26.22,63.92 | IC2.31 35.33,49.81 D2.C | R33.1 R30.1 | IC2.80 15.13,57.3 v15.11,57.28 | 10.26,56.34 C3.1
  Top 0.406: D2.C 36.8,46.93 R21.2 36.8,44.88 37.52,44.17 41.5,44.17 42.88,42.79 42.88,40.8 42.53,40.44 41.25,40.44 IC7.4 | C4.1 29.89,15.84 IC3.14 | 23.58,19 v20.1,19 | v10.42,19 10.51,19.09 U1.1 | 57.42,71.96 R28.1 57.42,72.64 58.03,73.33 59.65,73.33 63.41,77.09 v66.54,77.07 L2.2 | C15.1 67.58,31.39 v67.52,31.45 | v9.87,57.28 10.26,56.34 | C3.1 C2.1 C1.1
  Top 0.6: v66.85,98.3 64.41,100.74 64.41,102.46 59.74,107.14 53.75,107.14 52.43,105.82 52.43,102.46 50.6,100.64 50.39,100.64 48.26,98.5 36.27,98.5 33.53,95.76 33.53,95.15 DC2DC_1.3 | v33.81,45.57 36.68,45.57 R21.2 | v30.32,58.82 v30.32,49.33 | 56.69,36.42 55.17,34.9 54.36,34.9 C20.1 | 56.69,36.42 57.1,36.83 57.1,38.35 R30.1 | v57,36.22 56.9,36.22 56.69,36.42 | v65.74,27.48 68.48,27.48 68.99,26.98 F1.1 | v57.3,69.34 57.3,71.48 R28.1
  Top 0.61: U1.1 7.09,13.44 C11.+ | C12.1 33.34,88.84 DC2DC_1.3 | IC8.8 v47.21,59.25 | R33.1 v56.96,44.94 56.96,45.8 55.25,47.51 R3.2 | LED2.A 60.08,52.01 LED1.A 60.06,50.87 v60.95,49.98 | v41.41,63.06 41.49,63.14 v51.1,63.14 | IC3.14 26.78,15.81 23.58,19
  Bottom 0.254: R25.2 66.54,81.58 v66.54,77.07
  Bottom 0.356: 26.22,65.16 R47.2 | R47.2 25.72,65.19 R46.2 R45.2 29.64,65.19 R44.2 | R47.2 25.72,64.42 v26.22,63.92 | v15.11,57.28 10.35,57.28 v9.87,57.28
  Bottom 0.406: v20.1,19 v10.42,19 | SW1.7 70.61,88.65 68.66,86.91 68.66,86.3 R22.2 68.69,83.85 R25.2 | v67.52,31.45 67.52,29.26 v65.74,27.48 | v24.75,47.12 28.86,47.12 30.32,48.58 v30.32,49.33
  Bottom 0.6: v66.85,98.3 66.85,93.32 70.61,89.56 70.61,88.85 70.61,88.65 | v30.32,49.33 v33.81,45.57 | 29.77,65.08 R45.2 | v65.74,27.48 v57,36.22 56.79,36.42 56.79,36.93 42.57,51.16 34.75,51.16 30.85,55.15 | 33.02,31.04 33.02,29.41 22.76,19.15 20.22,19.15 v20.1,19 | v47.21,59.25 v51.1,63.14 v57.3,69.34
  Bottom 0.61: 33.02,31.04 38.2,36.22 v57,36.22 | v60.95,49.98 60.95,48.93 v56.96,44.94 | 30.85,55.15 30.34,55.66 v30.32,58.82 | R45.2 29.64,59.51 v30.32,58.82 | v30.32,58.82 34.56,63.06 v41.41,63.06 | v10.28,51.7 10.28,49.28 v13.4,46.16
VDD_IC
  Top 0.254: U$1.8 66.83,71.07 69.45,73.68 70.74,73.68 71.3,74.24 71.3,74.8 C16.1 | 71.36,74.97 C16.1 | C16.1 71.34,76.86 L2.1
VMOT
  Top 1.422: U$2.VS+ 70.61,55.97 71.41,55.97 73.34,54.04 U$5.P$6
XTAL1
  Top 0.254: IC2.34 34.86,51.31 38.4,51.31 Y1.3 | Y1.3 38.44,51.37 | Y1.3 40.45,51.37 R20.1
XTAL2  (via drill 0.25)
  Top 0.254: Y1.1 40.45,49.37 R20.2 v41.88,49.48 v41.89,49.47 | IC2.33 31.51,50.8 v31.5,50.79
  Bottom 0.254: v31.5,50.79 32.83,49.47 v41.89,49.47
XVCC
  Top 0.61: F1.2 76.58,22.99 USB.VBUS